# EAGLE design ArmazEthernet - Rev A3 (EAGLE 7.6.0)

## Sheet 1 of 2
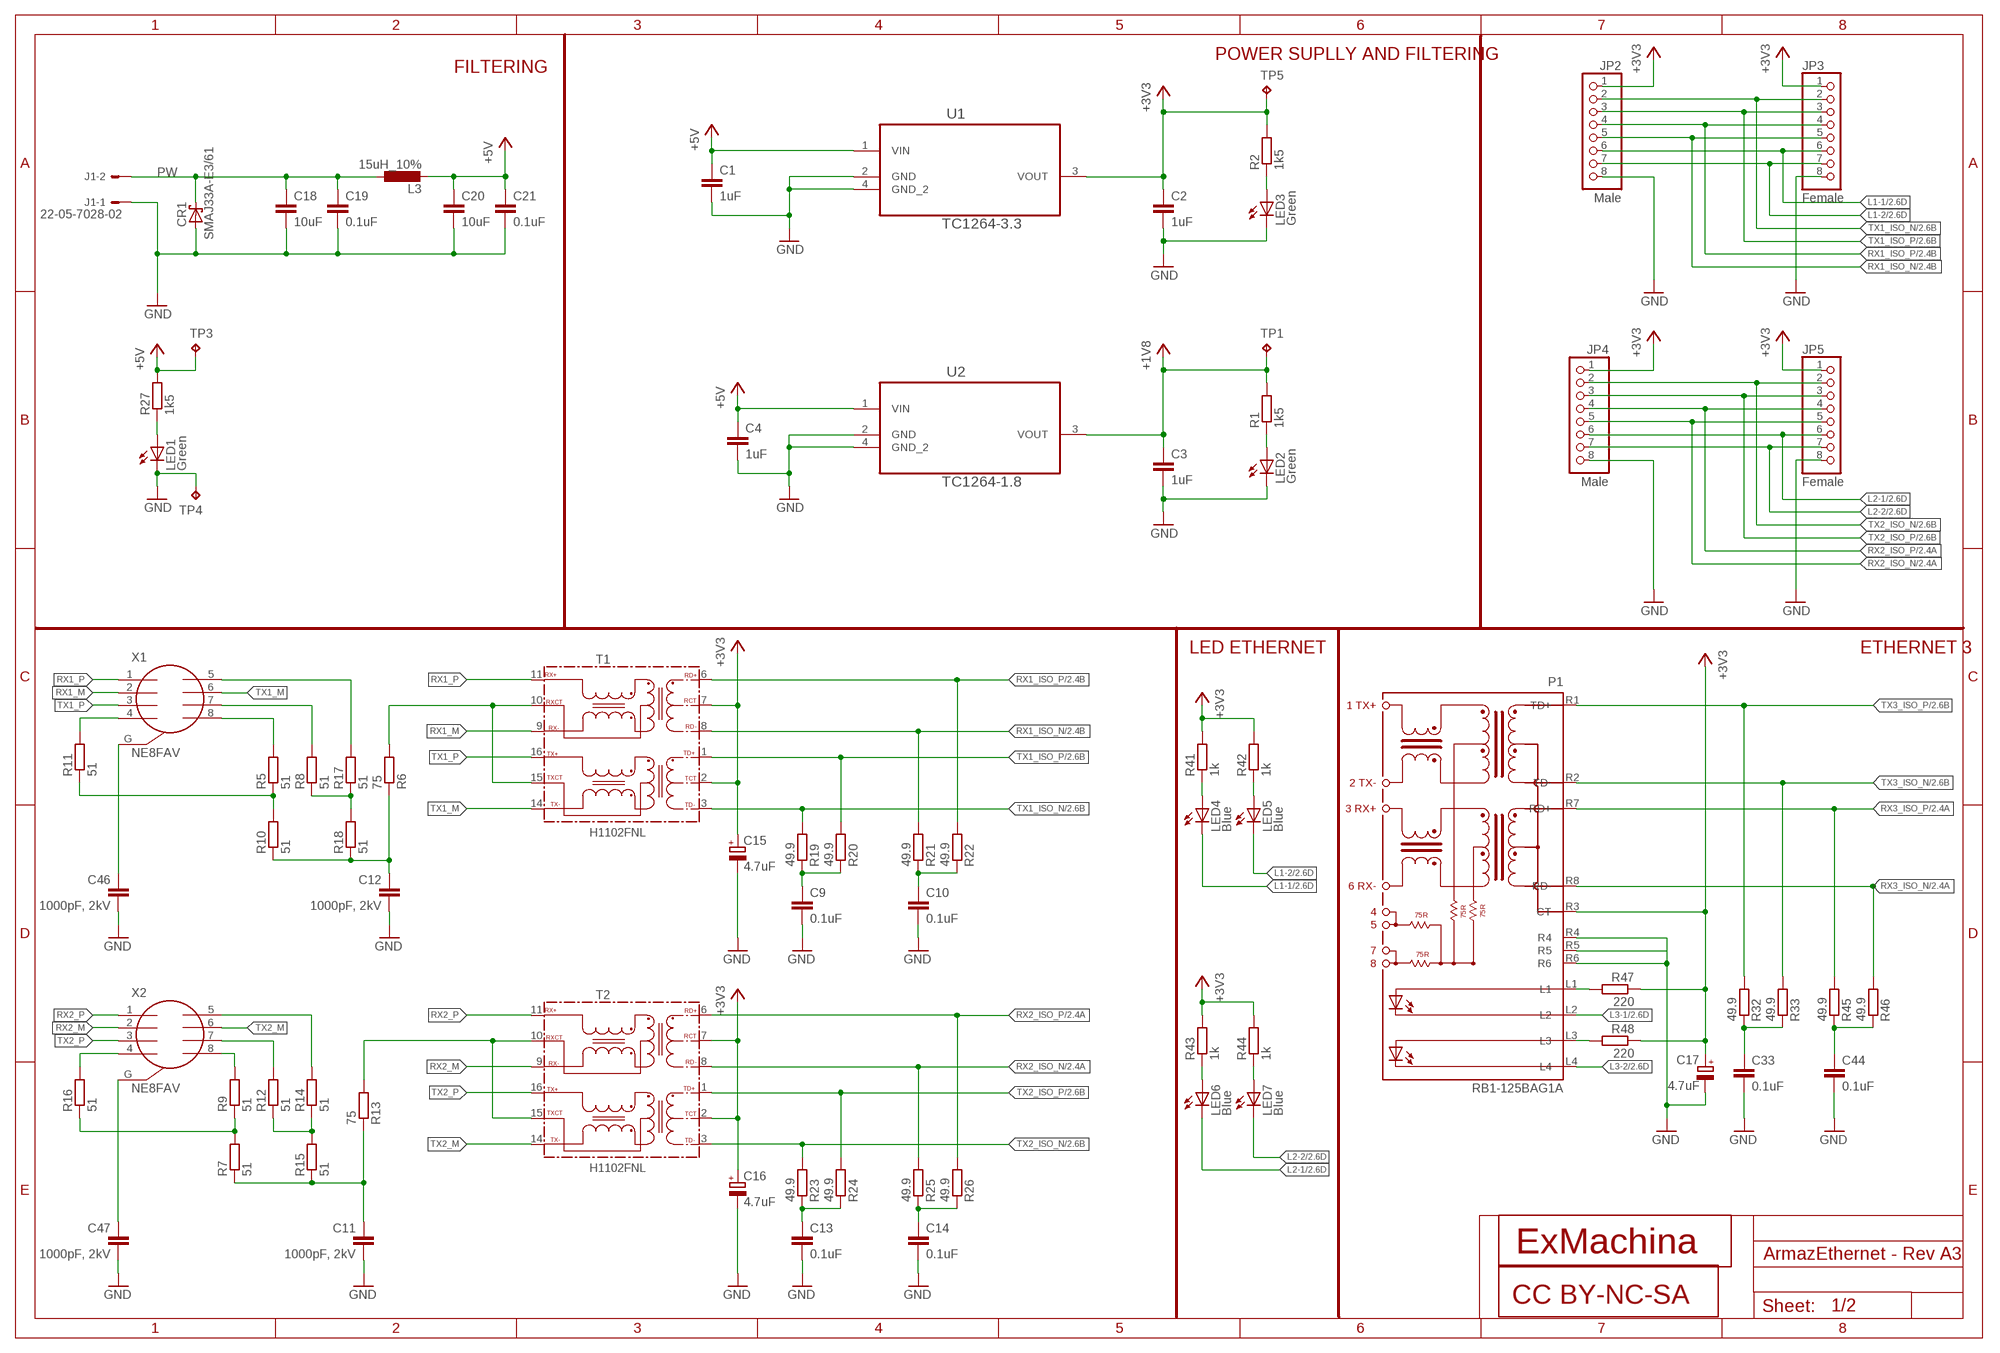
[diagram p0: schematic, sheet 1]

### Parts
C1  1uF  C-EUC0603  [C0603]
C2  1uF  C-EUC0603  [C0603]
C3  1uF  C-EUC0603  [C0603]
C4  1uF  C-EUC0603  [C0603]
C9  0.1uF  C-EUC0603  [C0603]
C10  0.1uF  C-EUC0603  [C0603]
C11  1000pF, 2kV  C-EUC1206  [C1206]
C12  1000pF, 2kV  C-EUC1206  [C1206]
C13  0.1uF  C-EUC0603  [C0603]
C14  0.1uF  C-EUC0603  [C0603]
C15  4.7uF  CPOL-EUCT3216  [CT3216]
C16  4.7uF  CPOL-EUCT3216  [CT3216]
C17  4.7uF  CPOL-EUCT3216  [CT3216]
C18  10uF  C-EUC0603  [C0603]
C19  0.1uF  C-EUC0603  [C0603]
C20  10uF  C-EUC0603  [C0603]
C21  0.1uF  C-EUC0603  [C0603]
C33  0.1uF  C-EUC0603  [C0603]
C44  0.1uF  C-EUC0603  [C0603]
C46  1000pF, 2kV  C-EUC1206  [C1206]
C47  1000pF, 2kV  C-EUC1206  [C1206]
CR1  SMAJ33A-E3/61  [DIODE_DO-214AC]
J1  22-05-7028-02  [7395-02]
JP2  Male  PINHD-1X8  [1X08]
JP3  Female  PINHD-1X8  [1X08]
JP4  Male  PINHD-1X8  [1X08]
JP5  Female  PINHD-1X8  [1X08]
L3  15uH_10%  L-EUL4532C  [L4532M]
LED1  Green  LEDCHIP-LED0603  [CHIP-LED0603]
LED2  Green  LEDCHIP-LED0603  [CHIP-LED0603]
LED3  Green  LEDCHIP-LED0603  [CHIP-LED0603]
LED4  Blue  LEDCHIP-LED0603  [CHIP-LED0603]
LED5  Blue  LEDCHIP-LED0603  [CHIP-LED0603]
LED6  Blue  LEDCHIP-LED0603  [CHIP-LED0603]
LED7  Blue  LEDCHIP-LED0603  [CHIP-LED0603]
P1  RB1-125BAG1A  [WIZNET_RB1-125BAG1A]
R1  1k5  R-EU_R0603  [R0603]
R2  1k5  R-EU_R0603  [R0603]
R5  51  R-EU_R0603  [R0603]
R6  75  R-EU_R0603  [R0603]
R7  51  R-EU_R0603  [R0603]
R8  51  R-EU_R0603  [R0603]
R9  51  R-EU_R0603  [R0603]
R10  51  R-EU_R0603  [R0603]
R11  51  R-EU_R0603  [R0603]
R12  51  R-EU_R0603  [R0603]
R13  75  R-EU_R0603  [R0603]
R14  51  R-EU_R0603  [R0603]
R15  51  R-EU_R0603  [R0603]
R16  51  R-EU_R0603  [R0603]
R17  51  R-EU_R0603  [R0603]
R18  51  R-EU_R0603  [R0603]
R19  49.9  R-EU_R0603  [R0603]
R20  49.9  R-EU_R0603  [R0603]
R21  49.9  R-EU_R0603  [R0603]
R22  49.9  R-EU_R0603  [R0603]
R23  49.9  R-EU_R0603  [R0603]
R24  49.9  R-EU_R0603  [R0603]
R25  49.9  R-EU_R0603  [R0603]
R26  49.9  R-EU_R0603  [R0603]
R27  1k5  R-EU_R0603  [R0603]
R32  49.9  R-EU_R0603  [R0603]
R33  49.9  R-EU_R0603  [R0603]
R41  1k  R-EU_R0603  [R0603]
R42  1k  R-EU_R0603  [R0603]
R43  1k  R-EU_R0603  [R0603]
R44  1k  R-EU_R0603  [R0603]
R45  49.9  R-EU_R0603  [R0603]
R46  49.9  R-EU_R0603  [R0603]
R47  220  R-EU_R0603  [R0603]
R48  220  R-EU_R0603  [R0603]
T1  H1102FNL  [HXXXX]
T2  H1102FNL  [HXXXX]
TP1  TPB1,27  [B1,27]
TP3  TPB1,27  [B1,27]
TP4  TPB1,27  [B1,27]
TP5  TPB1,27  [B1,27]
U1  TC1264-3.3  [SOT230P700X180-4N]
U2  TC1264-1.8  [SOT230P700X180-4N]
U$5  EXMACHINA-LOGO-NAME  [EXM-LOGO-BASELINE]
U$6  CC-BY-NC-SA  [CC-BY-NC-SA]
X1  NE8FAV  [NE8FAV]
X2  NE8FAV  [NE8FAV]

### Nets
+1V8: C3.1 R1.2 TP1.TP U2.3(VOUT) ; also sheet 2
+3V3: C2.1 C15.+ C16.+ C17.+ JP2.1 JP3.1 JP4.1 JP5.1 P1.R3(CT) R2.2 R41.2 R42.2 R43.2 R44.2 R47.1 R48.1 T1.2(TCT) T1.7(RCT) T2.2(TCT) T2.7(RCT) TP5.TP U1.3(VOUT) ; also sheet 2
+5V: C1.1 C4.1 C20.1 C21.1 L3.2 R27.2 TP3.TP U1.1(VIN) U2.1(VIN)
GND: C1.2 C2.2 C3.2 C4.2 C9.2 C10.2 C11.2 C12.2 C13.2 C14.2 C15.- C16.- C17.- C18.2 C19.2 C20.2 C21.2 C33.2 C44.2 C46.2 C47.2 CR1.2(A) J1.1 JP2.8 JP3.8 JP4.8 JP5.8 LED1.C LED2.C LED3.C P1.R4 P1.R5 P1.R6 TP4.TP U1.2(GND) U1.4(GND_2) U2.2(GND) U2.4(GND_2) ; also sheet 2
L1-1: JP2.6 JP3.6 LED4.C ; also sheet 2
L1-2: JP2.7 JP3.7 LED5.C ; also sheet 2
L2-1: JP4.6 JP5.6 LED6.C ; also sheet 2
L2-2: JP4.7 JP5.7 LED7.C ; also sheet 2
L3-1: P1.L2 ; also sheet 2
L3-2: P1.L4 ; also sheet 2
N$1: R6.2 T1.10(RXCT) T1.15(TXCT)
N$2: LED2.A R1.1
N$4: R13.2 T2.10(RXCT) T2.15(TXCT)
N$5: R9.2 X2.8
N$6: LED3.A R2.1
N$7: R11.2 X1.4
N$8: R5.2 X1.8
N$9: R8.2 X1.7
N$10: C9.1 R19.1 R20.1
N$11: R17.2 X1.5
N$12: R12.2 X2.7
N$13: C11.1 R7.1 R13.1 R15.1
N$14: R5.1 R10.2 R11.1
N$15: R16.2 X2.4
N$16: R7.2 R9.1 R16.1
N$17: R8.1 R17.1 R18.2
N$18: R14.2 X2.5
N$19: R12.1 R14.1 R15.2
N$20: LED4.A R41.1
N$23: LED1.A R27.1
N$27: C33.1 R32.1 R33.1
N$28: LED5.A R42.1
N$29: LED6.A R43.1
N$30: LED7.A R44.1
N$31: C44.1 R45.1 R46.1
N$32: C12.1 R6.1 R10.1 R18.1
N$33: C10.1 R21.1 R22.1
N$34: P1.L3 R48.2
N$35: P1.L1 R47.2
N$36: C47.1 X2.G
N$37: C46.1 X1.G
N$40: C13.1 R23.1 R24.1
N$41: C14.1 R25.1 R26.1
PW: C18.1 C19.1 CR1.1(C) J1.2 L3.1
RX1_ISO_N: JP2.5 JP3.5 R21.2 T1.8(RD-) ; also sheet 2
RX1_ISO_P: JP2.4 JP3.4 R22.2 T1.6(RD+) ; also sheet 2
RX1_M: T1.9(RX-) X1.2
RX1_P: T1.11(RX+) X1.1
RX2_ISO_N: JP4.5 JP5.5 R25.2 T2.8(RD-) ; also sheet 2
RX2_ISO_P: JP4.4 JP5.4 R26.2 T2.6(RD+) ; also sheet 2
RX2_M: T2.9(RX-) X2.2
RX2_P: T2.11(RX+) X2.1
RX3_ISO_N: P1.R8(RD-) R46.2 ; also sheet 2
RX3_ISO_P: P1.R7(RD+) R45.2 ; also sheet 2
TX1_ISO_N: JP2.2 JP3.2 R19.2 T1.3(TD-) ; also sheet 2
TX1_ISO_P: JP2.3 JP3.3 R20.2 T1.1(TD+) ; also sheet 2
TX1_M: T1.14(TX-) X1.6
TX1_P: T1.16(TX+) X1.3
TX2_ISO_N: JP4.2 JP5.2 R23.2 T2.3(TD-) ; also sheet 2
TX2_ISO_P: JP4.3 JP5.3 R24.2 T2.1(TD+) ; also sheet 2
TX2_M: T2.14(TX-) X2.6
TX2_P: T2.16(TX+) X2.3
TX3_ISO_N: P1.R2(TD-) R33.2 ; also sheet 2
TX3_ISO_P: P1.R1(TD+) R32.2 ; also sheet 2

### Notes on the sheet
- POWER SUPLLY AND FILTERING
- FILTERING
- LED ETHERNET | ETHERNET 3

## Sheet 2 of 2
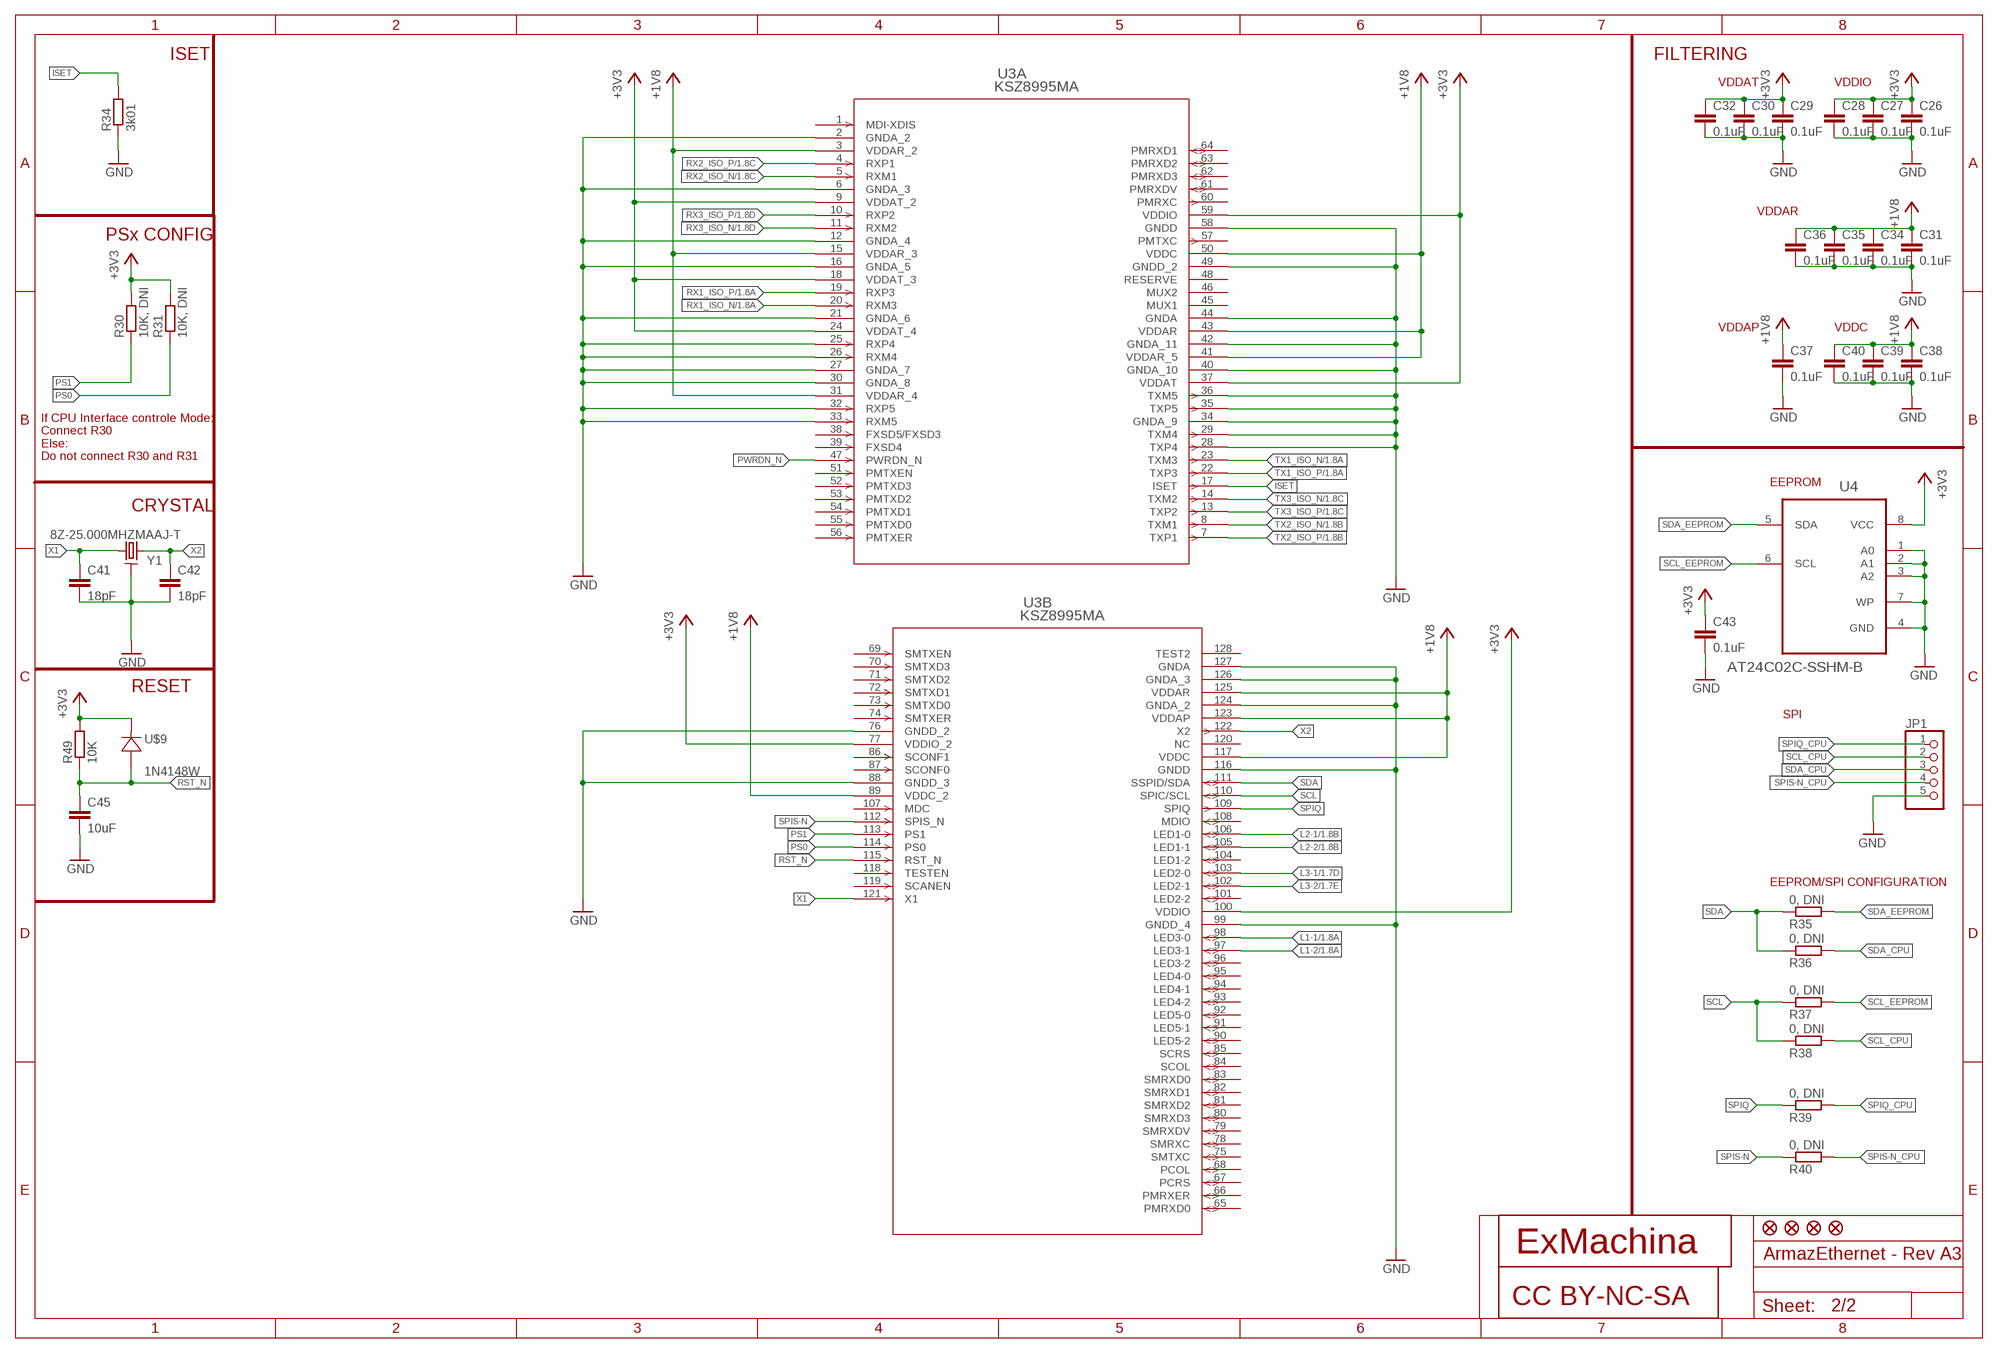
[diagram p1: schematic, sheet 2]

### Parts
C26  0.1uF  C-EUC0603  [C0603]
C27  0.1uF  C-EUC0603  [C0603]
C28  0.1uF  C-EUC0603  [C0603]
C29  0.1uF  C-EUC0603  [C0603]
C30  0.1uF  C-EUC0603  [C0603]
C31  0.1uF  C-EUC0603  [C0603]
C32  0.1uF  C-EUC0603  [C0603]
C34  0.1uF  C-EUC0603  [C0603]
C35  0.1uF  C-EUC0603  [C0603]
C36  0.1uF  C-EUC0603  [C0603]
C37  0.1uF  C-EUC0603  [C0603]
C38  0.1uF  C-EUC0603  [C0603]
C39  0.1uF  C-EUC0603  [C0603]
C40  0.1uF  C-EUC0603  [C0603]
C41  18pF  C-EUC0603  [C0603]
C42  18pF  C-EUC0603  [C0603]
C43  0.1uF  C-EUC0603  [C0603]
C45  10uF  C-EUC0603  [C0603]
JP1  PINHD-1X5  [1X05]
JP7  FIDUCIAL1X2  [FIDUCIAL-1X2]
JP8  FIDUCIAL1X2  [FIDUCIAL-1X2]
JP9  FIDUCIAL1X2  [FIDUCIAL-1X2]
JP10  FIDUCIAL1X2  [FIDUCIAL-1X2]
R30  10K, DNI  R-EU_R0603  [R0603]
R31  10K, DNI  R-EU_R0603  [R0603]
R34  3k01  R-EU_R0603  [R0603]
R35  0, DNI  R-EU_R0603  [R0603]
R36  0, DNI  R-EU_R0603  [R0603]
R37  0, DNI  R-EU_R0603  [R0603]
R38  0, DNI  R-EU_R0603  [R0603]
R39  0, DNI  R-EU_R0603  [R0603]
R40  0, DNI  R-EU_R0603  [R0603]
R49  10K  R-EU_R0603  [R0603]
U3  KSZ8995MA  [PQFP-128_MQL]
U4  AT24C02C-SSHM-B  [SOIC127P600X175-8N]
U$7  CC-BY-NC-SA  [CC-BY-NC-SA]
U$8  EXMACHINA-LOGO-NAME  [EXM-LOGO-BASELINE]
U$9  1N4148W  [SOD-123_MINI-SMA]
Y1  8Z-25.000MHZMAAJ-T  [SMD2.5X2]

### Nets
+1V8: C31.1 C34.1 C35.1 C36.1 C37.1 C38.1 C39.1 C40.1 U3.3(A:VDDAR_2) U3.15(A:VDDAR_3) U3.31(A:VDDAR_4) U3.41(A:VDDAR_5) U3.43(A:VDDAR) U3.50(A:VDDC) U3.89(B:VDDC_2) U3.117(B:VDDC) U3.123(B:VDDAP) U3.125(B:VDDAR) ; also sheet 1
+3V3: C26.1 C27.1 C28.1 C29.1 C30.1 C32.1 C43.1 R30.2 R31.2 R49.2 U3.9(A:VDDAT_2) U3.18(A:VDDAT_3) U3.24(A:VDDAT_4) U3.37(A:VDDAT) U3.59(A:VDDIO) U3.77(B:VDDIO_2) U3.100(B:VDDIO) U4.8(VCC) U$9.C ; also sheet 1
GND: C26.2 C27.2 C28.2 C29.2 C30.2 C31.2 C32.2 C34.2 C35.2 C36.2 C37.2 C38.2 C39.2 C40.2 C41.2 C42.2 C43.2 C45.2 JP1.5 R34.1 U3.2(A:GNDA_2) U3.6(A:GNDA_3) U3.12(A:GNDA_4) U3.16(A:GNDA_5) U3.21(A:GNDA_6) U3.25(A:RXP4) U3.26(A:RXM4) U3.27(A:GNDA_7) U3.28(A:TXP4) U3.29(A:TXM4) U3.30(A:GNDA_8) U3.32(A:RXP5) U3.33(A:RXM5) U3.34(A:GNDA_9) U3.35(A:TXP5) U3.36(A:TXM5) U3.40(A:GNDA_10) U3.42(A:GNDA_11) U3.44(A:GNDA) U3.49(A:GNDD_2) U3.58(A:GNDD) U3.76(B:GNDD_2) U3.88(B:GNDD_3) U3.99(B:GNDD_4) U3.116(B:GNDD) U3.124(B:GNDA_2) U3.126(B:GNDA_3) U3.127(B:GNDA) U4.1(A0) U4.2(A1) U4.3(A2) U4.4(GND) U4.7(WP) Y1.2 Y1.4 ; also sheet 1
ISET: R34.2 U3.17(A:ISET)
L1-1: U3.98(B:LED3-0) ; also sheet 1
L1-2: U3.97(B:LED3-1) ; also sheet 1
L2-1: U3.106(B:LED1-0) ; also sheet 1
L2-2: U3.105(B:LED1-1) ; also sheet 1
L3-1: U3.103(B:LED2-0) ; also sheet 1
L3-2: U3.102(B:LED2-1) ; also sheet 1
PS0: R31.1 U3.114(B:PS0)
PS1: R30.1 U3.113(B:PS1)
PWRDN_N: U3.47(A:PWRDN_N)
RST_N: C45.1 R49.1 U3.115(B:RST_N) U$9.A
RX1_ISO_N: U3.20(A:RXM3) ; also sheet 1
RX1_ISO_P: U3.19(A:RXP3) ; also sheet 1
RX2_ISO_N: U3.5(A:RXM1) ; also sheet 1
RX2_ISO_P: U3.4(A:RXP1) ; also sheet 1
RX3_ISO_N: U3.11(A:RXM2) ; also sheet 1
RX3_ISO_P: U3.10(A:RXP2) ; also sheet 1
SCL: R37.1 R38.1 U3.110(B:SPIC/SCL)
SCL_CPU: JP1.2 R38.2
SCL_EEPROM: R37.2 U4.6(SCL)
SDA: R35.1 R36.1 U3.111(B:SSPID/SDA)
SDA_CPU: JP1.3 R36.2
SDA_EEPROM: R35.2 U4.5(SDA)
SPIQ: R39.1 U3.109(B:SPIQ)
SPIQ_CPU: JP1.1 R39.2
SPIS-N: R40.1 U3.112(B:SPIS_N)
SPIS-N_CPU: JP1.4 R40.2
TX1_ISO_N: U3.23(A:TXM3) ; also sheet 1
TX1_ISO_P: U3.22(A:TXP3) ; also sheet 1
TX2_ISO_N: U3.8(A:TXM1) ; also sheet 1
TX2_ISO_P: U3.7(A:TXP1) ; also sheet 1
TX3_ISO_N: U3.14(A:TXM2) ; also sheet 1
TX3_ISO_P: U3.13(A:TXP2) ; also sheet 1
X1: C41.1 U3.121(B:X1) Y1.1
X2: C42.1 U3.122(B:X2) Y1.3
Unconnected: U3.1(A:MDI-XDIS) U3.38(A:FXSD5/FXSD3) U3.39(A:FXSD4) U3.45(A:MUX1) U3.46(A:MUX2) U3.48(A:RESERVE) U3.51(A:PMTXEN) U3.52(A:PMTXD3) U3.53(A:PMTXD2) U3.54(A:PMTXD1) U3.55(A:PMTXD0) U3.56(A:PMTXER) U3.57(A:PMTXC) U3.60(A:PMRXC) U3.61(A:PMRXDV) U3.62(A:PMRXD3) U3.63(A:PMRXD2) U3.64(A:PMRXD1) U3.65(B:PMRXD0) U3.66(B:PMRXER) U3.67(B:PCRS) U3.68(B:PCOL) U3.69(B:SMTXEN) U3.70(B:SMTXD3) U3.71(B:SMTXD2) U3.72(B:SMTXD1) U3.73(B:SMTXD0) U3.74(B:SMTXER) U3.75(B:SMTXC) U3.78(B:SMRXC) U3.79(B:SMRXDV) U3.80(B:SMRXD3) U3.81(B:SMRXD2) U3.82(B:SMRXD1) U3.83(B:SMRXD0) U3.84(B:SCOL) U3.85(B:SCRS) U3.86(B:SCONF1) U3.87(B:SCONF0) U3.90(B:LED5-2) U3.91(B:LED5-1) U3.92(B:LED5-0) U3.93(B:LED4-2) U3.94(B:LED4-1) U3.95(B:LED4-0) U3.96(B:LED3-2) U3.101(B:LED2-2) U3.104(B:LED1-2) U3.107(B:MDC) U3.108(B:MDIO) U3.118(B:TESTEN) U3.119(B:SCANEN) U3.120(B:NC) U3.128(B:TEST2)

### Notes on the sheet
- ISET | FILTERING
- VDDAT | VDDIO
- VDDAR
- PSx CONFIG
- VDDAP | VDDC
- If CPU Interface controle Mode:
  Connect R30
  Else:
  Do not connect R30 and R31
- EEPROM
- CRYSTAL
- RESET
- SPI
- EEPROM/SPI CONFIGURATION

## Library data of the parts
C1-C4 = rcl:C-EU: CAPACITOR, European symbol; OC_FARNELL: unknown
C9 C10 C13 C14 C19 C21 C26-C40 C43 C44 = rcl:C-EU: CAPACITOR, European symbol; MF: MULTICOMP; MPN: MC0603B104K250CT; OC_FARNELL: 1759037; OC_NEWARK: 06R4923
C11 C12 C46 C47 = rcl:C-EU: CAPACITOR, European symbol; OC_FARNELL: unknown; OC_NEWARK: 21T9879
C15-C17 = rcl:CPOL-EU: POLARIZED CAPACITOR, European symbol; OC_FARNELL: unknown; OC_NEWARK: 01M8221
C18 C20 C45 = rcl:C-EU: CAPACITOR, European symbol; MF: MURATA; MPN: GRM32DR71C106KA01L; OC_FARNELL: 2494299; OC_NEWARK: 13M5149
C41 C42 = rcl:C-EU: CAPACITOR, European symbol; MF: MULTICOMP; MPN: MC0603B183K160CT; OC_FARNELL: 1759006; OC_NEWARK: 06R5138
CR1 = diode:SMAJ33A-E3/61; COPYRIGHT: Copyright (C) 2015 Accelerated Designs. All rights reserved; FAMILY: TVS; MANUFACTURER_NAME: Vishay; MANUFACTURER_PART_NUMBER: SMAJ33A-E3/61; MF: VISHAY; MPN: SMAJ33A-E3/5A; OC_FARNELL: 1812505; OC_NEWARK: 08R3790; RSPARTNUMBER: 7103462; SECTION: Discretes; SUPERSECTION: Semiconductors; VENDOR: Vishay
J1 = con-molex:22-?-02: CONNECTOR wire to board 2.54 mm (.1 inch) pitch header; MF: MOLEX; MPN: 22-05-7028; OC_FARNELL: 9731601; OC_NEWARK: 25M1728
JP1 = pinhead:PINHD-1X5: PIN HEADER; OC_FARNELL: unknown; OC_NEWARK: 97K6210
JP2 JP4 = pinhead:PINHD-1X8: PIN HEADER; MF: SAMTEC; MPN: TSW-108-15-T-S; OC_FARNELL: 2037596; OC_NEWARK: 08N6749
JP3 JP5 = pinhead:PINHD-1X8: PIN HEADER; MF: SAMTEC; MPN: SLW-108-01-T-S; OC_FARNELL: 1803516; OC_NEWARK: 08N6773
JP7-JP10 = SparkFun:FIDUCIAL: Fiducial Alignment Points Various fiducial points for machine vision alignment.; OC_FARNELL: unknown
L3 = rcl:L-EU: INDUCTOR, European symbol; OC_FARNELL: unknown; OC_NEWARK: 74M2809
LED1-LED3 = led:LED: LED OSRAM: - CHIPLED LG R971, LG N971, LY N971, LG Q971, LY Q971, LO R971, LY R971 LH N974, LH R974 LS Q976, LO Q976, LY Q976 LO Q996 - Hyper CHIPLED LW Q18S LB Q993, LB Q99A, LB R99A - SideLED LS A670, LO A670, LY A670, LG A670, LP A670 LB A673, LV A673, LT A673, LW A673 LH A674 LY A675 LS A676, LA A676, LO A676, LY A676, LW A676 LS A679, LY A679, LG A679 - Hyper Micro SIDELED® LS Y876, LA Y876, LO Y876, LY Y876 LT Y87S - SmartLED LW L88C, LW L88S LB L89C, LB L89S, LG L890 LS L89K, LO L89K, LY L89K LS L896, LA L896, LO L896, LY L896 - TOPLED LS T670, LO T670, LY T670, LG T670, LP T670 LSG T670, LSP T670, LSY T670, LOP T670, LYG T670 LG T671, LOG T671, LSG T671 LB T673, LV T673, LT T673, LW T673 LH T674 LS T676, LA T676, LO T676, LY T676, LB T676, LH T676, LSB T676, LW T676 LB T67C, LV T67C, LT T67C, LS T67K, LO T67K, LY T67K, LW E67C LS E67B, LA E67B, LO E67B, LY E67B, LB E67C, LV E67C, LT E67C LW T67C LS T679, LY T679, LG T679 LS T770, LO T770, LY T770, LG T770, LP T770 LB T773, LV T773, LT T773, LW T773 LH T774 LS E675, LA E675, LY E675, LS T675 LS T776, LA T776, LO T776, LY T776, LB T776 LHGB T686 LT T68C, LB T68C - Hyper Mini TOPLED® LB M676 - Mini TOPLED Santana® LG M470 LS M47K, LO M47K, LY M47K Source: http://www.osram.convergy.de LUXEON: - LUMILED® LXK2-PW12-R00, LXK2-PW12-S00, LXK2-PW14-U00, LXK2-PW14-V00 LXK2-PM12-R00, LXK2-PM12-S00, LXK2-PM14-U00 LXK2-PE12-Q00, LXK2-PE12-R00, LXK2-PE12-S00, LXK2-PE14-T00, LXK2-PE14-U00 LXK2-PB12-K00, LXK2-PB12-L00, LXK2-PB12-M00, LXK2-PB14-N00, LXK2-PB14-P00, LXK2-PB14-Q00 LXK2-PR12-L00, LXK2-PR12-M00, LXK2-PR14-Q00, LXK2-PR14-R00 LXK2-PD12-Q00, LXK2-PD12-R00, LXK2-PD12-S00 LXK2-PH12-R00, LXK2-PH12-S00 LXK2-PL12-P00, LXK2-PL12-Q00, LXK2-PL12-R00 Source: www.luxeon.com KINGBRIGHT: KA-3528ASYC Source: www.kingbright.com; MF: MULTICOMP; MPN: OVS-0604; OC_FARNELL: 1716771; OC_NEWARK: 15R2206
LED4-LED7 = led:LED: LED OSRAM: - CHIPLED LG R971, LG N971, LY N971, LG Q971, LY Q971, LO R971, LY R971 LH N974, LH R974 LS Q976, LO Q976, LY Q976 LO Q996 - Hyper CHIPLED LW Q18S LB Q993, LB Q99A, LB R99A - SideLED LS A670, LO A670, LY A670, LG A670, LP A670 LB A673, LV A673, LT A673, LW A673 LH A674 LY A675 LS A676, LA A676, LO A676, LY A676, LW A676 LS A679, LY A679, LG A679 - Hyper Micro SIDELED® LS Y876, LA Y876, LO Y876, LY Y876 LT Y87S - SmartLED LW L88C, LW L88S LB L89C, LB L89S, LG L890 LS L89K, LO L89K, LY L89K LS L896, LA L896, LO L896, LY L896 - TOPLED LS T670, LO T670, LY T670, LG T670, LP T670 LSG T670, LSP T670, LSY T670, LOP T670, LYG T670 LG T671, LOG T671, LSG T671 LB T673, LV T673, LT T673, LW T673 LH T674 LS T676, LA T676, LO T676, LY T676, LB T676, LH T676, LSB T676, LW T676 LB T67C, LV T67C, LT T67C, LS T67K, LO T67K, LY T67K, LW E67C LS E67B, LA E67B, LO E67B, LY E67B, LB E67C, LV E67C, LT E67C LW T67C LS T679, LY T679, LG T679 LS T770, LO T770, LY T770, LG T770, LP T770 LB T773, LV T773, LT T773, LW T773 LH T774 LS E675, LA E675, LY E675, LS T675 LS T776, LA T776, LO T776, LY T776, LB T776 LHGB T686 LT T68C, LB T68C - Hyper Mini TOPLED® LB M676 - Mini TOPLED Santana® LG M470 LS M47K, LO M47K, LY M47K Source: http://www.osram.convergy.de LUXEON: - LUMILED® LXK2-PW12-R00, LXK2-PW12-S00, LXK2-PW14-U00, LXK2-PW14-V00 LXK2-PM12-R00, LXK2-PM12-S00, LXK2-PM14-U00 LXK2-PE12-Q00, LXK2-PE12-R00, LXK2-PE12-S00, LXK2-PE14-T00, LXK2-PE14-U00 LXK2-PB12-K00, LXK2-PB12-L00, LXK2-PB12-M00, LXK2-PB14-N00, LXK2-PB14-P00, LXK2-PB14-Q00 LXK2-PR12-L00, LXK2-PR12-M00, LXK2-PR14-Q00, LXK2-PR14-R00 LXK2-PD12-Q00, LXK2-PD12-R00, LXK2-PD12-S00 LXK2-PH12-R00, LXK2-PH12-S00 LXK2-PL12-P00, LXK2-PL12-Q00, LXK2-PL12-R00 Source: www.luxeon.com KINGBRIGHT: KA-3528ASYC Source: www.kingbright.com; MF: MULTICOMP; MPN: OVS-0603; OC_FARNELL: 1716770; OC_NEWARK: 15R2205
P1 = con-wiznet:RB1-125BAG1A: Accessory RJ-45 With Transformer Connector - UDE; OC_FARNELL: unknown; OC_NEWARK: unknown
R1 R2 R27 = rcl:R-EU_: RESISTOR, European symbol; MF: MULTICOMP; MPN: MCMR06X1501FTL; OC_FARNELL: 2073391; OC_NEWARK: 58K4488
R5 R7-R12 R14-R18 = rcl:R-EU_: RESISTOR, European symbol; MF: MULTICOMP; MPN: MCMR06X49R9FTL; OC_FARNELL: 2073520; OC_NEWARK: 58K4614
R6 R13 = rcl:R-EU_: RESISTOR, European symbol; MF: MULTICOMP; MPN: MCMR06X75R0FTL; OC_FARNELL: 2073571; OC_NEWARK: 58K4654
R19-R26 R32 R33 R45 R46 = rcl:R-EU_: RESISTOR, European symbol; MF: MULTICOMP; MPN: MCMR06X49R9FTL; OC_FARNELL: 2073520; OC_NEWARK: 79M5983
R30 R31 = rcl:R-EU_: RESISTOR, European symbol; OC_FARNELL: unknown; OC_NEWARK: 58K4450
R34 = rcl:R-EU_: RESISTOR, European symbol; MF: MULTICOMP; MPN: MCMR06X3001FTL; OC_FARNELL: 2073461; OC_NEWARK: 94W5780
R35-R40 = rcl:R-EU_: RESISTOR, European symbol; OC_FARNELL: unknown; OC_NEWARK: 58K4684
R41-R44 = rcl:R-EU_: RESISTOR, European symbol; MF: MULTICOMP; MPN: MCMR06X1001FTL; OC_FARNELL: 2073348; OC_NEWARK: 86T3505
R47 R48 = rcl:R-EU_: RESISTOR, European symbol; MF: MULTICOMP; MPN: MCMR06X2200FTL; OC_FARNELL: 2073428; OC_NEWARK: 58K4526
R49 = rcl:R-EU_: RESISTOR, European symbol; MF: MULTICOMP; MPN: MCMR06X1002FTL; OC_FARNELL: 2073349; OC_NEWARK: 58K4450
T1 T2 = pulse:H1102FNL; OC_FARNELL: unknown; OC_NEWARK: unknown
TP1 TP3-TP5 = testpad:TP: Test pad; OC_FARNELL: unknown; OC_NEWARK: unknown
U1 = microchip-6:TC1264-3.3: IC, 8 00mA Fixed Output CMOS LDO,3.3V,SOT-223, 3-lead; OC_FARNELL: unknown; PACKAGE: SOT-223-3; SUPPLIER: Microchip
U2 = microchip-6:TC1264-1.8: IC, 800mA Fixed Output CMOS LDO,1.8V,SOT-223, 3-lead; OC_FARNELL: unknown; PACKAGE: SOT-223-3; SUPPLIER: Microchip
U3 = Micrel_By_element14_Batch_1:KSZ8995MA; COPYRIGHT: Copyright (C) 2015 Accelerated Designs. All rights reserved; MANUFACTURER_PART_NUMBER: ksz8995ma; MF: MICROCHIP; MPN: KSZ8995MA; OC_FARNELL: 2509844; OC_NEWARK: 70Y9044; VENDOR: MICREL
U4 = atmel:AT24C02C-SSHM-B: SERIAL EEPROM IC Memory Size:2Kbit,8-SOIC; MF: ATMEL; MPN: AT24C02C-SSHM-B; OC_FARNELL: 1971995; OC_NEWARK: 68T4066; PACKAGE: 8SOIC; SUPPLIER: ATMEL
U$5 U$8 = exmachina:EXMACHINA-LOGO; OC_FARNELL: unknown; OC_NEWARK: unknown
U$6 U$7 = cc-by-sa:CC-BY-NC-SA; OC_FARNELL: unknown
U$9 = diode:1N4148W; OC_FARNELL: unknown; OC_NEWARK: 01P4213
X1 X2 = con-neutrik_ag:NE8; MF: NEUTRIK; MPN: NE8FAV; OC_FARNELL: 1202031; OC_NEWARK: 01M8373
Y1 = crystal:8Z; MF: TXC; MPN: 8Z-25.000MAAJ-T; OC_FARNELL: 1842189; OC_NEWARK: 84R5794

## Board
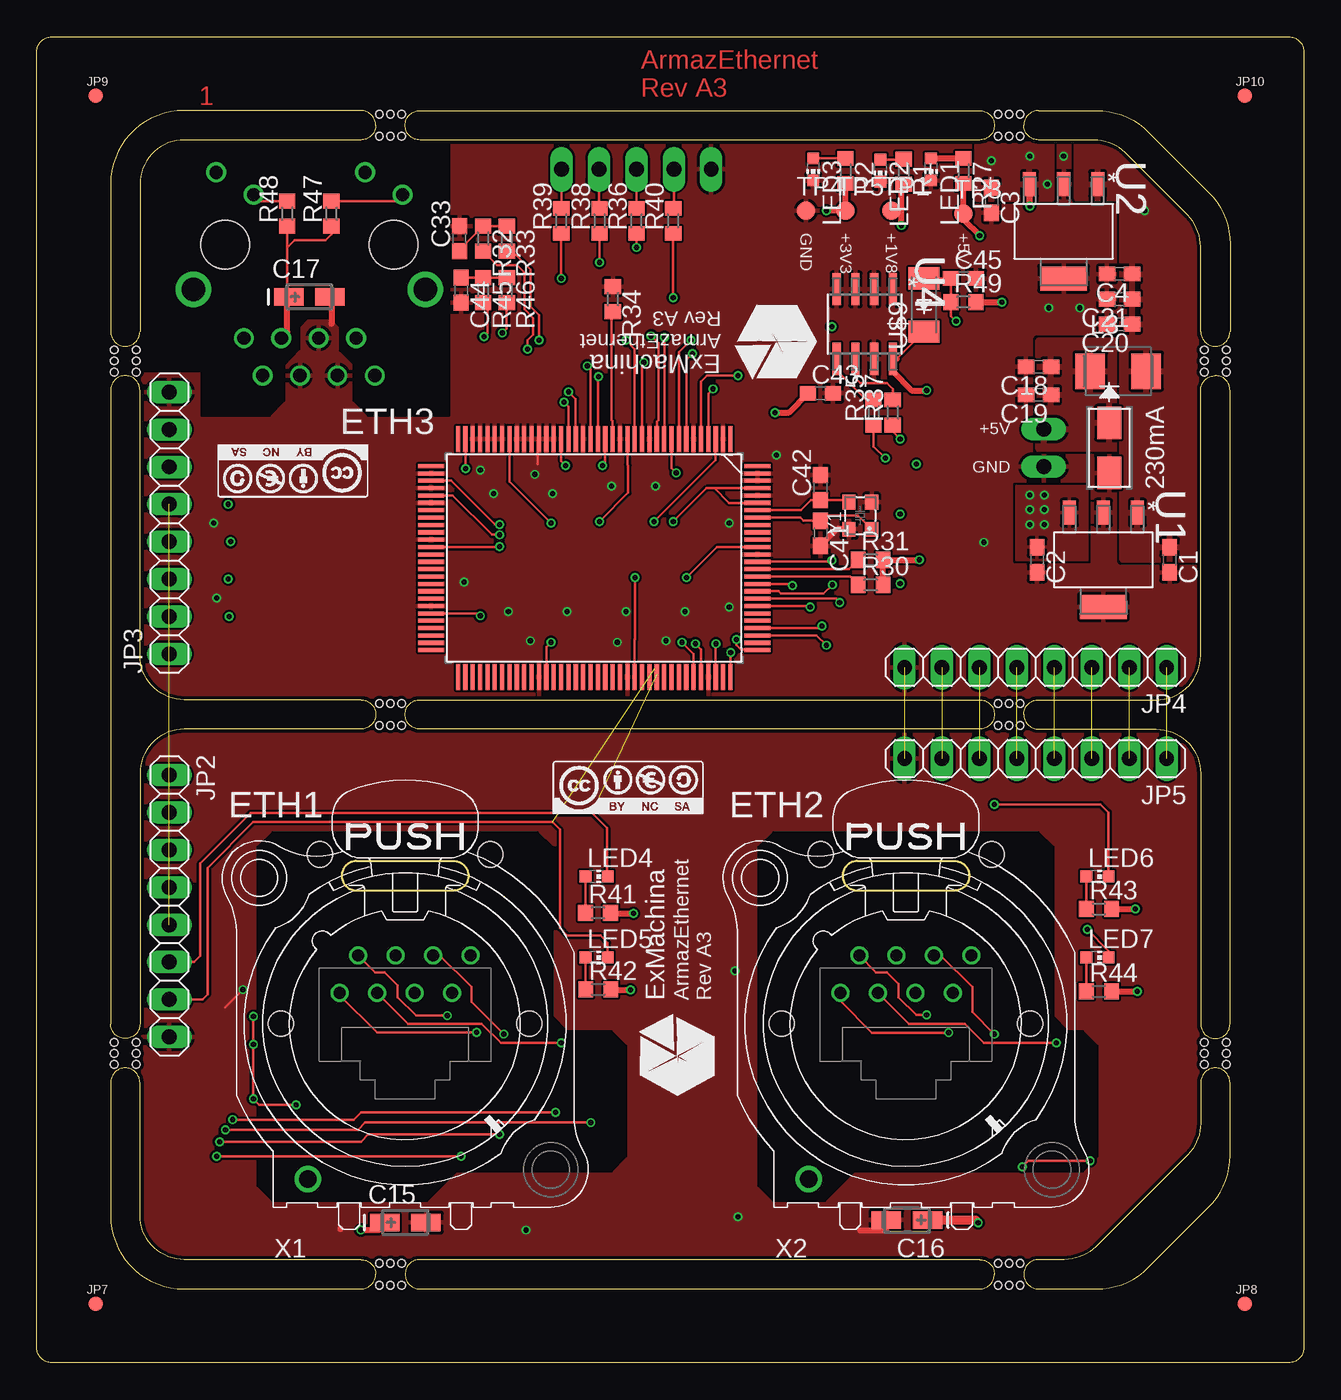
[diagram p2: board, top side]
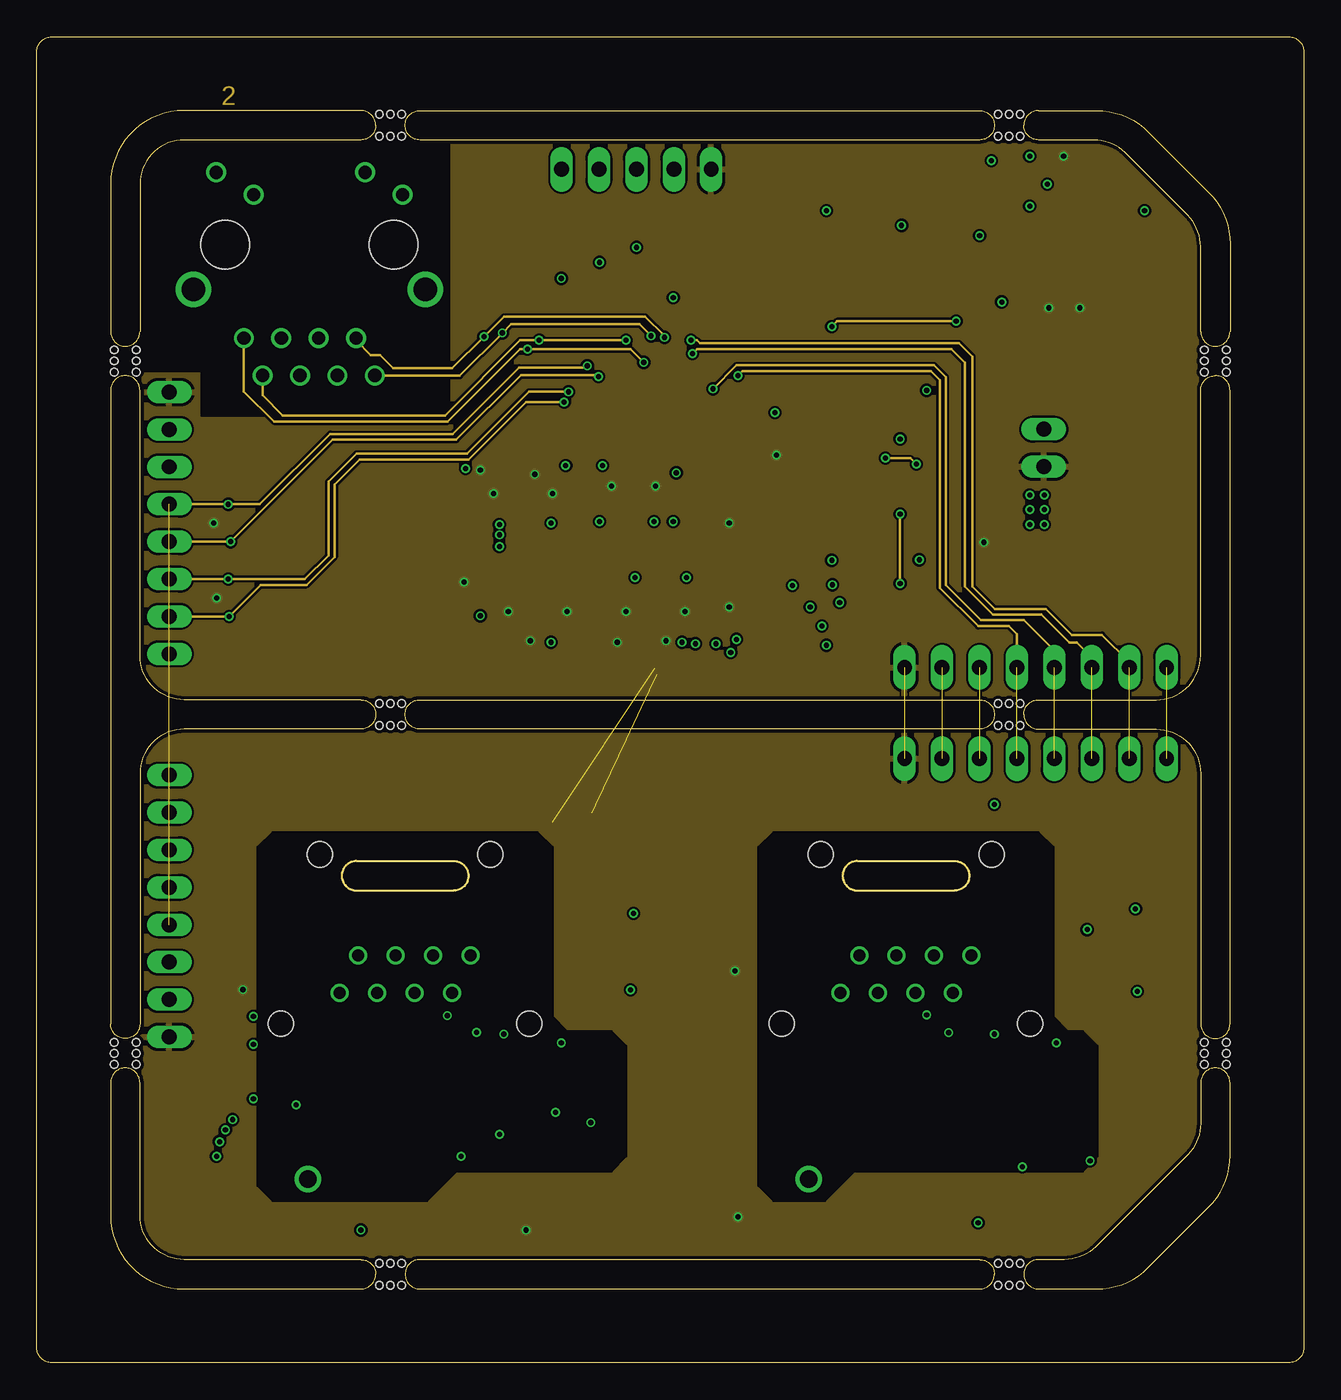
[diagram p3: board, inner layer Route2]
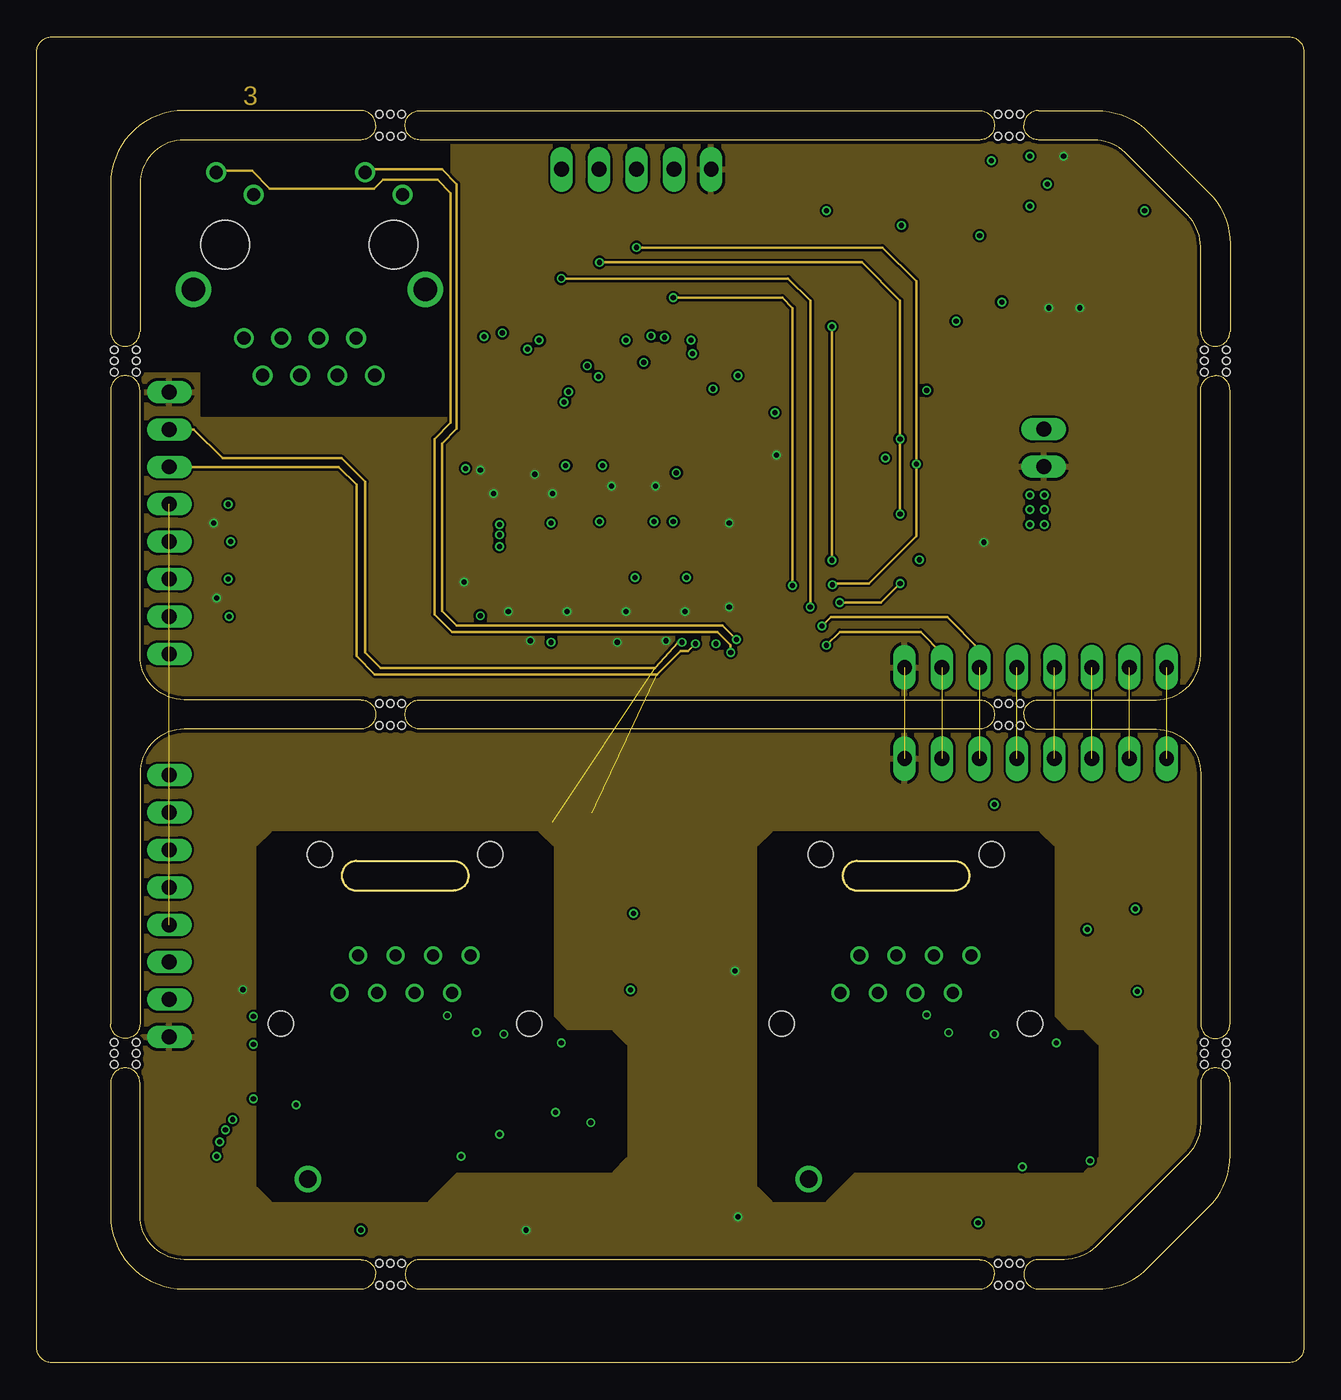
[diagram p4: board, inner layer Route15]
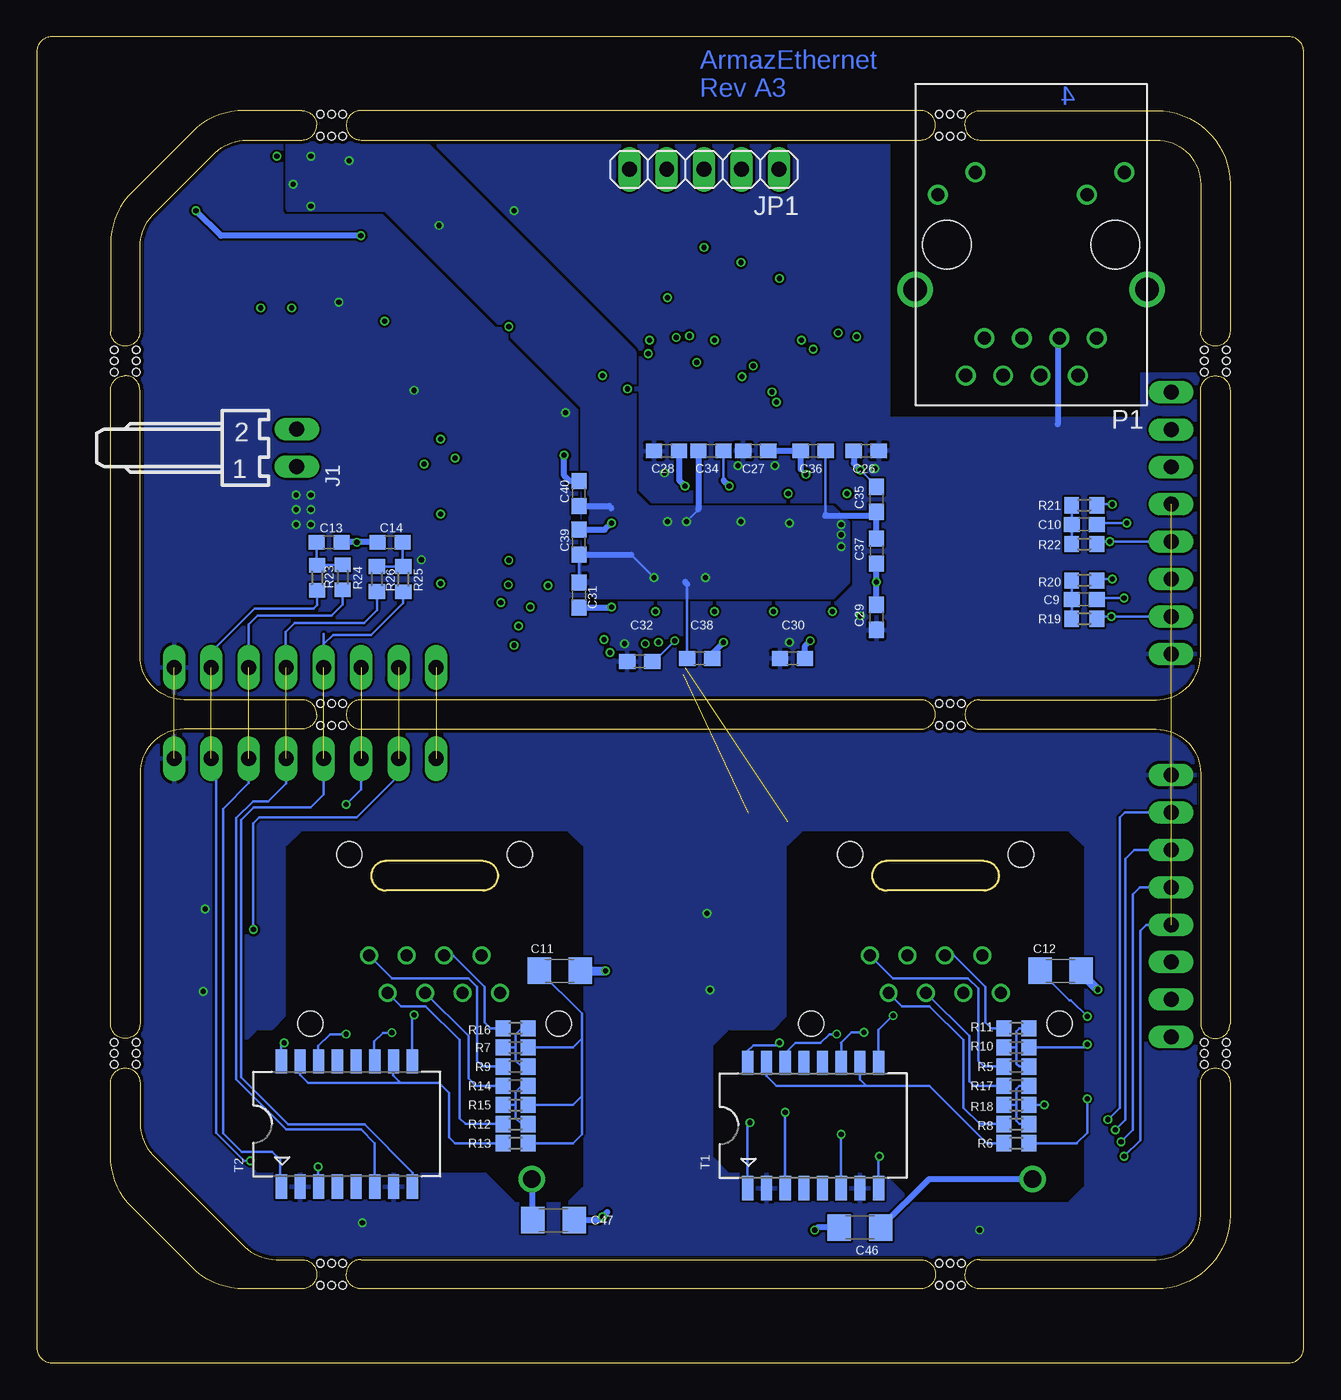
[diagram p5: board, bottom side, seen from below]

Size 86 x 90 mm. Coordinates in mm from the lower left corner, seen from the top.
Outline: 79,19 79,16.24 arc-45 78.12,14.12 71.88,7.88 arc-45 69.76,7 68,7 arc90 67,6 arc90 68,5 71.93,5 arc45 75.46,6.46 79.54,10.54 arc45 81,14.07 81,19 arc90 80,20 arc90 79,19
Outline: 64,7 26,7 arc90 25,6 arc90 26,5 64,5 arc90 65,6 arc90 64,7
Outline: 22,7 10,7 arc-90 7,10 7,19 arc90 6,20 arc90 5,19 5,10 arc90 10,5 22,5 arc90 23,6 arc90 22,7
Outline: 22,45 10,45 arc-90 7,48 7,66 arc90 6,67 arc90 5,66 5,23 arc90 6,22 arc90 7,23 7,40 arc-90 10,43 22,43 arc90 23,44 arc90 22,45
Outline: 68,43 76,43 arc-90 79,40 79,23 arc90 80,22 arc90 81,23 81,66 arc90 80,67 arc90 79,66 79,48 arc-90 76,45 68,45 arc90 67,44 arc90 68,43
Outline: 79,70 79,75.76 arc45 78.12,77.88 73.88,82.12 arc45 71.76,83 68,83 arc-90 67,84 arc-90 68,85 71.93,85 arc-45 75.46,83.54 79.54,79.46 arc-45 81,75.93 81,70 arc-90 80,69 arc-90 79,70
Outline: 26,45 64,45 arc-90 65,44 arc-90 64,43 26,43 arc-90 25,44 arc-90 26,45
Outline: 5,80 5,70 arc90 6,69 arc90 7,70 7,80 arc-90 10,83 22,83 arc90 23,84 arc90 22,85 10,85 arc90 5,80
Outline: 65,84 arc-90 64,83 26,83 arc-90 25,84 arc-90 26,85 64,85 arc-90 65,84
Outline: 0,1 0,89 arc-90 1,90 85,90 arc-90 86,89 86,1 arc-90 85,0 1,0 arc-90 0,1
Copper layers (1+2*15+16): Top 0.018mm / dielectric 0.36mm / Route2 0.035mm / dielectric 0.71mm / Route15 0.035mm / dielectric 0.2mm / Bottom 0.018mm
Design rules "eC_4Layer_PClass6_BaseCopperO18-I35_eCDefault *": minimum track width 7mil, minimum drill 0.35mm, track to track 0.15mm, track to pad 0.15mm, pad to pad 0.15mm, via to via 0.15mm, smd to smd 0mil, copper to edge 0.25mm, drill to drill 0.35mm, minimum pad ring 0.175mm, minimum via ring 0.125mm, stop-mask expansion 0mil, vias tented up to drill 0.5mm, thermal gap 0.2mm
Holes 0.5 mm at 5.25,67.25 5.25,68 5.25,68.75 6.75,68.75 6.75,68 6.75,67.25 24,84.75 23.25,84.75 24.75,84.75 23.25,83.25 24,83.25 24.75,83.25 65.25,84.75 66,84.75 66.75,84.75 65.25,83.25 66,83.25 66.75,83.25 79.25,68 79.25,68.75 79.25,67.25 80.75,67.25 80.75,68 80.75,68.75 79.25,21.75 79.25,21 79.25,20.25 80.75,20.25 80.75,21 80.75,21.75 66,6.75 65.25,6.75 66.75,6.75 66,5.25 66.75,5.25 65.25,5.25 24,6.75 24.75,6.75 23.25,6.75 23.25,5.25 24,5.25 24.75,5.25 5.25,21 5.25,21.75 5.25,20.25 6.75,20.25 6.75,21 6.75,21.75 24,44.75 23.25,44.75 24.75,44.75 24.75,43.25 24,43.25 23.25,43.25 66,44.75 65.25,44.75 66.75,44.75 66.75,43.25 66,43.25 65.25,43.25

### Footprints (pad centres in the part's own frame; a part is rotated, then mirrored left to right if it is on the bottom)
C0603 = smd 1.1 x 1: 1 -0.85,0; 2 0.85,0
C1206 = smd 1.6 x 1.8: 1 -1.4,0; 2 1.4,0
CT3216 = smd 2 x 1.2: + -1.4,0; - 1.4,0
DIODE_DO-214AC = smd 2.184 x 1.651: 1 -1.702,0; 2 1.702,0
7395-02 = drill 1.016 long: 1 1.27,0; 2 -1.27,0
1X05 = drill 1.016 long: 1 -5.08,0; 2 -2.54,0; 3 0,0; 4 2.54,0; 5 5.08,0
1X08 = drill 1.016 long: 1 -8.89,0; 2 -6.35,0; 3 -3.81,0; 4 -1.27,0; 5 1.27,0; 6 3.81,0; 7 6.35,0; 8 8.89,0
FIDUCIAL-1X2 = smd 1 x 1: 1 0,0
L4532M = smd 2 x 2.4: 1 -1.9,0; 2 1.9,0
CHIP-LED0603 = smd 0.8 x 0.8: A 0,-0.75; C 0,0.75
WIZNET_RB1-125BAG1A = drill 0.9: L1 6.325,-3.38; L2 3.784,-4.899; L3 -3.786,-3.379; L4 -6.325,-4.9 | drill 0.9 pad 1.3: R1 -4.446,6.349; R2 -3.176,8.889; R3 -1.906,6.349; R4 -0.636,8.889; R5 0.634,6.349; R6 1.904,8.889; R7 3.174,6.349; R8 4.444,8.889 | drill 1.6 pad 2.184: S1 -7.876,3.049; S2 7.874,3.049 | hole 3.3: 5.714,-0.001; -5.716,-0.001
R0603 = smd 1 x 1.1: 1 -0.85,0; 2 0.85,0
HXXXX = smd 0.762 x 1.651: 1 -4.445,-4.255; 2 -3.175,-4.255; 3 -1.905,-4.255; 4 -0.635,-4.255; 5 0.635,-4.255; 6 1.905,-4.255; 7 3.175,-4.255; 8 4.445,-4.255; 9 4.445,4.255; 10 3.175,4.255; 11 1.905,4.255; 12 0.635,4.255; 13 -0.635,4.255; 14 -1.905,4.255; 15 -3.175,4.255; 16 -4.445,4.255
B1,27 = smd 1.27 x 1.27: TP 0,0
SOT230P700X180-4N = smd 1.626 x 0.889: 1 -3.2,2.311; 2 -3.2,0; 3 -3.2,-2.311 | smd 1.626 x 3.175: 4 3.2,0
PQFP-128_MQL = smd 1.753 x 0.279: 1 -8.077,9.25; 2 -8.077,8.75; 3 -8.077,8.25; 4 -8.077,7.75; 5 -8.077,7.25; 6 -8.077,6.75; 7 -8.077,6.25; 8 -8.077,5.75; 9 -8.077,5.25; 10 -8.077,4.75; 11 -8.077,4.25; 12 -8.077,3.75; 13 -8.077,3.25; 14 -8.077,2.75; 15 -8.077,2.25; 16 -8.077,1.75; 17 -8.077,1.25; 18 -8.077,0.75; 19 -8.077,0.25; 20 -8.077,-0.25; 21 -8.077,-0.75; 22 -8.077,-1.25; 23 -8.077,-1.75; 24 -8.077,-2.25; 25 -8.077,-2.75; 26 -8.077,-3.25; 27 -8.077,-3.75; 28 -8.077,-4.25; 29 -8.077,-4.75; 30 -8.077,-5.25; 31 -8.077,-5.75; 32 -8.077,-6.25; 33 -8.077,-6.75; 34 -8.077,-7.25; 35 -8.077,-7.75; 36 -8.077,-8.25; 37 -8.077,-8.75; 38 -8.077,-9.25; 65 8.077,-9.25; 66 8.077,-8.75; 67 8.077,-8.25; 68 8.077,-7.75; 69 8.077,-7.25; 70 8.077,-6.75; 71 8.077,-6.25; 72 8.077,-5.75; 73 8.077,-5.25; 74 8.077,-4.75; 75 8.077,-4.25; 76 8.077,-3.75; 77 8.077,-3.25; 78 8.077,-2.75; 79 8.077,-2.25; 80 8.077,-1.75; 81 8.077,-1.25; 82 8.077,-0.75; 83 8.077,-0.25; 84 8.077,0.25; 85 8.077,0.75; 86 8.077,1.25; 87 8.077,1.75; 88 8.077,2.25; 89 8.077,2.75; 90 8.077,3.25; 91 8.077,3.75; 92 8.077,4.25; 93 8.077,4.75; 94 8.077,5.25; 95 8.077,5.75; 96 8.077,6.25; 97 8.077,6.75; 98 8.077,7.25; 99 8.077,7.75; 100 8.077,8.25; 101 8.077,8.75; 102 8.077,9.25 | smd 0.279 x 1.753: 39 -6.25,-11.074; 40 -5.75,-11.074; 41 -5.25,-11.074; 42 -4.75,-11.074; 43 -4.25,-11.074; 44 -3.75,-11.074; 45 -3.25,-11.074; 46 -2.75,-11.074; 47 -2.25,-11.074; 48 -1.75,-11.074; 49 -1.25,-11.074; 50 -0.75,-11.074; 51 -0.25,-11.074; 52 0.25,-11.074; 53 0.75,-11.074; 54 1.25,-11.074; 55 1.75,-11.074; 56 2.25,-11.074; 57 2.75,-11.074; 58 3.25,-11.074; 59 3.75,-11.074; 60 4.25,-11.074; 61 4.75,-11.074; 62 5.25,-11.074; 63 5.75,-11.074; 64 6.25,-11.074; 103 6.25,11.074; 104 5.75,11.074; 105 5.25,11.074; 106 4.75,11.074; 107 4.25,11.074; 108 3.75,11.074; 109 3.25,11.074; 110 2.75,11.074; 111 2.25,11.074; 112 1.75,11.074; 113 1.25,11.074; 114 0.75,11.074; 115 0.25,11.074; 116 -0.25,11.074; 117 -0.75,11.074; 118 -1.25,11.074; 119 -1.75,11.074; 120 -2.25,11.074; 121 -2.75,11.074; 122 -3.25,11.074; 123 -3.75,11.074; 124 -4.25,11.074; 125 -4.75,11.074; 126 -5.25,11.074; 127 -5.75,11.074; 128 -6.25,11.074
SOIC127P600X175-8N = smd 2.184 x 0.559: 1 -2.362,1.905; 2 -2.362,0.635; 3 -2.362,-0.635; 4 -2.362,-1.905; 5 2.362,-1.905; 6 2.362,-0.635; 7 2.362,0.635; 8 2.362,1.905
SOD-123_MINI-SMA = smd 1.5 x 2.1: A 1.8,0; C -1.8,0
NE8FAV = drill 0.813: 1 -4.445,2.108; 2 -3.175,4.648; 3 -1.905,2.108; 4 -0.635,4.648; 5 0.635,2.108; 6 1.905,4.648; 7 3.175,2.108; 8 4.445,4.648 | drill 1.194: G -6.604,-10.541 | hole 1.7: -8.425,0; 8.425,0; 5.8,11.5; -5.8,11.5
SMD2.5X2 = smd 1 x 0.9: 1 -0.925,-0.775; 2 0.925,-0.775; 3 0.925,0.775; 4 -0.925,0.775

### Placement (x,y rotation side)
C1  76.9,54.5 270 top
C2  67.9,54.5 270 top
C3  64.8,78.9 270 top
C4  73.5,73.9 180 top
C9  14.9,51.8 0 bottom
C10  14.9,56.9 0 bottom
C11  50.5,26.6 0 bottom
C12  16.5,26.6 0 bottom
C13  66.16,55.69 0 bottom
C14  62.02,55.69 180 bottom
C15  25.01,9.51 0 top
C16  59.07,9.68 180 top
C17  18.5,72.35 0 top
C18  68,67.6 180 top
C19  68,65.7 180 top
C20  73.5,70.5 180 top
C21  73.5,72.2 180 top
C26  29.7,61.9 180 bottom
C27  37.2,61.9 0 bottom
C28  43.25,61.89 0 bottom
C29  29,50.6 90 bottom
C30  34.7,47.8 0 bottom
C31  49.2,52.1 270 bottom
C32  45.08,47.6 0 bottom
C33  28.7,76.3 90 top
C34  40.23,61.89 0 bottom
C35  29,58.6 90 bottom
C36  33.3,61.9 180 bottom
C37  29,55.1 270 bottom
C38  41,47.8 0 bottom
C39  49.2,55.7 90 bottom
C40  49.2,59 90 bottom
C41  53.2,56.3 270 top
C42  53.2,59.4 90 top
C43  53.2,65.8 0 top
C44  28.8,72.8 270 top
C45  62.9,73.6 0 top
C46  30.12,9.18 180 bottom
C47  50.93,9.67 0 bottom
CR1  72.8,62.1 270 top
J1  68.35,62.1 270 bottom
JP1  40.7,81 180 bottom
JP2  9,31 270 top
JP3  9,57 90 top
JP4  67.8,47.2 180 top
JP5  67.8,41 180 top
JP7  4,4 0 top
JP8  82,4 0 top
JP9  4,86 0 top
JP10  82,86 0 top
L3  73.4,67.3 0 top
LED1  60.7,81 180 top
LED2  57.26,80.91 180 top
LED3  52.7,81 180 top
LED4  38,33 270 top
LED5  38,27.5 270 top
LED6  72,33 270 top
LED7  72,27.5 270 top
P1  18.5,75.9 180 bottom
R1  58.84,80.84 270 top
R2  54.9,80.9 270 top
R5  19.5,20.1 180 bottom
R6  19.5,14.9 180 bottom
R7  53.5,21.4 180 bottom
R8  19.5,16.2 180 bottom
R9  53.5,20.1 180 bottom
R10  19.5,21.4 180 bottom
R11  19.5,22.7 180 bottom
R12  53.5,16.2 180 bottom
R13  53.5,14.9 180 bottom
R14  53.5,18.8 180 bottom
R15  53.5,17.5 180 bottom
R16  53.5,22.7 180 bottom
R17  19.5,18.8 180 bottom
R18  19.5,17.5 180 bottom
R19  14.9,50.5 0 bottom
R20  14.9,53.1 0 bottom
R21  14.9,58.2 0 bottom
R22  14.9,55.56 0 bottom
R23  66.97,53.28 270 bottom
R24  65.23,53.31 270 bottom
R25  61.12,53.18 270 bottom
R26  62.91,53.19 270 bottom
R27  62.9,80.9 270 top
R30  56.6,52.8 0 top
R31  56.6,54.5 0 top
R32  30.3,76.3 270 top
R33  31.9,76.3 270 top
R34  39.1,72.2 270 top
R35  56.8,64.5 90 top
R36  40.7,77.5 90 top
R37  58.1,64.5 90 top
R38  38.2,77.5 90 top
R39  35.6,77.5 90 top
R40  43.2,77.5 90 top
R41  38.09,30.54 0 top
R42  38.11,25.34 0 top
R43  72.1,30.8 0 top
R44  72.1,25.2 0 top
R45  30.3,72.8 270 top
R46  31.9,72.8 270 top
R47  20,78 90 top
R48  17,78 90 top
R49  62.9,72 0 top
T1  33.3,16.1 0 bottom
T2  64.96,16.2 0 bottom
TP1  58,78.2 0 top
TP3  62.9,78 0 top
TP4  52.2,78.2 0 top
TP5  54.9,78.2 0 top
U1  72.4,54.5 270 top
U2  69.7,76.8 270 top
U3  37.84,54.62 270 top
U4  56.2,70.5 270 top
U$5  50.23,69.33 180 top
U$6  17.39,60.56 180 top
U$7  40.14,39.02 0 top
U$8  43.5,20.8 90 top
U$9  60.23,71.8 90 top
X1  25,23 0 top
X2  59,23 0 top
Y1  55.9,57.5 90 top

### Tracks (layer width: path | path; a pad name or v marks a point on that pad's centre or on a via)
+1V8  (via drill 0.35)
  Top 0.178: U3.3 46.09,61.28 v41.9,57.1 | U3.43 28.23,58.87 30.9,56.2 v31.4,56.2 | U3.41 28.14,59.87 31.1,56.9 v31.4,56.9 | v38.2,57.1 40.15,59.05 40.15,60.91 40.09,60.97 U3.15 | U3.125 46,59.37 | 46,59.37 45.47,59.37 v43.2,57.1 | v44.1,53.3 46.16,55.37 U3.117 | 40.59,53.28 v40.6,53.3 40.6,49.1 40.59,49.09 U3.89 | U3.31 32.09,59.81 v34.9,57 | U3.50 31.36,55.37 v31.4,55.4 | U3.123 47,58.37 46,59.37
  Top 0.406: 58.71,79.86 R1.2 58.7,79.85 58.7,78.4 | v58.7,77.2 58.7,78.4 | TP1.TP 58.5,78.2 58.7,78.4 | v67.4,78.5 U2.3
  Bottom 0.178: 41.85,47.84 C38.1 41.85,52.85 | C31.1 C39.1 | C36.1 32.45,57.55 | 41.09,57.91 v41.9,57.1 | 45.65,54.85 v44.1,53.3
  Bottom 0.406: C37.1 C35.1 29.25,57.5 32.5,57.5 32.45,57.55 | C34.1 41.09,57.91 | 41.85,52.85 42,53 | C39.1 45.65,54.85 | C40.1 47.15,58.15 47,58
  other vias: 68.6,80 67.4,81.9 64.8,81.6
  pour Top: 63.83,89.1 63.83,79 68.9,79 68.9,89.1
  pour Bottom: 65.1,88.2 45.5,68.6 45.5,59 44.5,58 32,58 31,57 31,53 32,52 48,52 48.9,52.9 48.9,64.9 62.3,78.3 68.9,78.3 68.9,88.2
+3V3  (via drill 0.35)  (1 unrouted)
  Top 0.178: 58.37,68.14 U$9.C | U3.59 29.93,50.87 v30.1,50.7 | U3.24 35.59,61.22 v35.9,60.9 | U3.18 38.59,61.09 v38.4,60.9 | U3.9 43.09,60.72 v43.4,60.4 | U3.77 34.59,48.59 v34.9,48.9 | U3.37 29.1,62.68 v29.1,60.7 | v46.1,48.8 46.19,48.72 46.09,48.62 U3.100 | R47.1 20,76.6 19.6,76.2 17.5,76.2 17,75.7 | 17,75.7 17,73 17.1,72.9 C17.+ | R48.1 17,75.7
  Top 0.406: 58.37,68.14 U4.8 58.1,67.3 59.4,66 v60.4,66 | R30.2 R31.2 v59.9,54.5 | R49.2 v65.5,72 | R2.2 TP5.TP v53.6,78.2 | R41.2 38.98,30.5 v40.5,30.5 | R42.2 38.99,25.3 v40.3,25.3 | R43.2 v74.58,30.8 | R44.2 v74.7,25.2 | v50.1,64.5 51.05,64.5 C43.1 | P1.R3 17,69.96 17,72.25 C17.+ | v22,9 23.2,9 23.61,9.41 C15.+
  Top 0.61: C16.+ 63.72,9.68 v63.9,9.5
  Bottom 0.406: 36.45,11.87 T1.2 | P1.R3 16.7,69.44 16.7,63.7
  other vias: 67.4,58.9 67.4,57.9 68.4,57.9 68.4,58.9 68.4,56.9 67.4,56.9
  pour Bottom (rank 5): 4,86 82,86 82,4 4,4
  pour Top: 66.5,54.5 66.5,59.5 71.3,59.5 71.3,54.5
+5V  (via drill 0.35)
  Top 0.406: v64,76.5 62.9,77.6 TP3.TP R27.2
  Bottom 0.406: v64,76.5 73.5,76.5 v75.2,78.2
  pour Top: 85.3,54.5 73.7,54.5 73.7,79 70.6,79 70.6,83.1 85.3,83.1
GND  (via drill 0.35)  (1 unrouted)
  Top 0.178: 56.67,58.12 Y1.2 | U3.27 34,62.61 34,61 | 12.78,24.11 v13.98,25.32 | v12.2,51.9 12.2,52
  Top 0.406: 20.61,9.09 20.6,9.07 | 55.89,8.97 57.66,8.97 | 72.8,60.83 CR1.2 72.37,60.83 | Y1.2 56.67,58.48 | Y1.4 54.33,56.58 C41.2 | C42.2 53.2,60.6 | C17.- 20,72.25 20,70.5
  Bottom 0.178: C34.2 39.38,59.88 | 29,59.5 v30.1,60.6 | 34.15,60.65 v33.8,60.3 | 15.1,26.43 C12.2 | C10.2 13.95,57 v12,57 | C9.2 13.95,51.9 v12.2,51.9 | C32.2 44.1,47.6 v42.7,49
  Bottom 0.406: C14.2 v64.28,55.69 C13.2 | C27.2 C36.2 34.15,60.65 | C29.2 v29,53 C37.2 | 39.38,59.88 v39,59.5 | C28.2 42.4,59.9 v42,59.5 | C35.2 29,59.5 | C26.2 30.55,61.05 v30.1,60.6 | C30.2 33.85,48.65 v33.5,49 | C38.2 40.15,48.15 v39.4,48.9 | C31.2 47.05,51.25 v47,51.3 | C39.2 47.45,56.55 v47,57 | 47.27,10.23 v47.6,9.9 47.83,9.67 C47.2 | C40.2 49.85,59.85 50.2,60.2 v50.2,61.6 | C46.2 33.02,9.18 v33.2,9
  Bottom 0.61: v13.98,25.32 15.1,26.43 | C11.2 v47.4,26.6
  other vias: 32,51 31,59 36,51 40,51 44,51 35,59 69.7,81.9 70.8,71.6 68.7,71.6
  pour Top (rank 6): 5,85 81,85 81,5 5,5
  pour Route2: 6,84 80,84 80,6 6,6
  pour Route15: 3,87 3,3 83,3 83,87
ISET
  Top 0.178: 39.1,62.71 U3.17 39.09,63.91 39,64 39,71.25 R34.2
L1-1  (via drill 0.35)  (1 unrouted)
  Top 0.178: LED4.C 38.7,33.05 38.7,36.3 37.7,37.3 14.5,37.3 11.1,33.9 11.1,27.6 10.69,27.19 JP2.6 | v44.7,48.8 45.09,48.41 U3.98
  Route15 0.178: JP3.6 20.49,60.81 21.7,59.6 21.7,47.95 22.95,46.71 42.11,46.71 43.7,48.3 44.2,48.3 v44.7,48.8
L1-2  (via drill 0.35)  (1 unrouted)
  Top 0.178: LED5.C 38.75,28.5 38.25,29 36,29 35.5,29.5 35.5,36.2 35,36.7 14.7,36.7 11.6,33.6 11.6,25 11.25,24.65 JP2.7 | v43.8,48.9 44.59,48.12 U3.97
  Route15 0.178: JP3.7 10.65,63.35 12.6,61.4 20.7,61.4 22.3,59.8 22.3,48.19 23.34,47.15 41.95,47.15 43.51,48.9 v43.8,48.9
L2-1  (via drill 0.35)  (1 unrouted)
  Top 0.178: U3.106 53.16,49.87 v53.3,50 | v65,37.9 72.2,37.9 72.75,37.35 LED6.C
  Route15 0.178: v53.3,50 53.9,50.6 61.8,50.6 63.99,48.41 JP4.6
  Bottom 0.178: JP5.6 63.99,38.91 v65,37.9
L2-2  (via drill 0.35)  (1 unrouted)
  Top 0.178: v71.3,29.4 72.75,27.95 LED7.C | U3.105 52.94,49.37 v53.6,48.7
  Route15 0.178: JP4.7 61.45,48.15 60,49.6 54.5,49.6 v53.6,48.7
  Bottom 0.178: JP5.7 61.45,39.85 64.3,37 70.9,37 71.3,36.6 v71.3,29.4
L3-1  (via drill 0.35)
  Top 0.178: v47.5,49.1 47.5,48.7 47.8,48.4 48.87,48.4 U3.103
  Route15 0.178: v47.5,49.1 46.56,50.04 28.49,50.04 27.5,51.03 27.5,62.4 28.5,63.4 28.5,80 27.5,81 22.48,81 P1.L2
L3-2  (via drill 0.35)
  Top 0.178: v47.1,48.2 47.09,48.19 U3.102
  Route15 0.178: P1.L4 12.28,80.9 14.6,80.9 15.8,79.7 22.9,79.7 23.5,80.3 27.2,80.3 28.1,79.4 28.1,63.8 27,62.7 27,50.8 28.2,49.6 46.2,49.6 47.1,48.7 v47.1,48.2
N$1
  Bottom 0.178: R6.2 21.5,14.9 25.4,18.8 29.7,18.8 | 29.7,18.8 35.8,18.8 36.48,19.48 T1.15 | T1.10 30.12,19.23 29.7,18.8
N$2
  Top 0.178: LED2.A 58.81,81.66 R1.1
N$4
  Bottom 0.178: T2.15 68.14,19.54 67.6,19 61.3,19 | 61.3,19 58.7,19 58,18.3 58,15.3 57.6,14.9 R13.2 | T2.10 61.8,20.44 61.8,19.5 61.3,19
N$5
  Bottom 0.178: X2.8 61.9,26.1 56.7,26.1 56.1,25.5 56.1,20.5 55.7,20.1 R9.2
N$6
  Top 0.178: LED3.A R2.1
N$7
  Bottom 0.178: X1.4 23.75,27.65 21.6,25.5 21.6,23.1 21.2,22.7 R11.2
N$8
  Bottom 0.178: X1.8 27.9,26.1 22.8,26.1 22.1,25.4 22.1,20.5 21.7,20.1 R5.2
N$9
  Bottom 0.178: X1.7 27.27,24.2 25.4,24.2 23.1,21.9 23.1,17.3 22,16.2 R8.2
N$10
  Bottom 0.178: R20.1 C9.1 R19.1
N$11
  Bottom 0.178: X1.5 22.7,22.17 22.7,19.1 22.4,18.8 R17.2
N$12
  Bottom 0.178: X2.7 61.27,24.2 59.6,24.2 57.3,21.9 57.3,16.6 56.9,16.2 R12.2
N$13
  Bottom 0.178: C11.1 49,23.7 49,22 | 49,22 49,18.1 | 49,18.1 49,15.5 49.6,14.9 R13.1 | R7.1 49.6,21.4 49,22 | R15.1 49.6,17.5 49,18.1
N$14
  Bottom 0.178: R11.1 19.3,22.7 19.5,22.5 19.5,21.4 | 19.5,21.4 19.5,20.3 19.3,20.1 R5.1 | 20.4,21.4 R10.2 19.5,21.4
N$15
  Bottom 0.178: R16.2 55.2,22.7 55.6,23.1 55.6,25.5 57.75,27.65 X2.4
N$16
  Bottom 0.178: R16.1 53.1,22.7 53.5,22.3 53.5,21.4 | 53.5,21.4 53.5,20.5 53.1,20.1 R9.1 | R7.2 53.5,21.4
N$17
  Bottom 0.178: R17.1 19.3,18.8 19.5,18.6 19.5,17.5 | 19.5,17.5 19.5,16.4 19.3,16.2 R8.1 | R18.2 19.5,17.5
N$18
  Bottom 0.178: X2.5 56.7,22.17 56.7,19.3 56.2,18.8 R14.2
N$19
  Bottom 0.178: R14.1 53.1,18.8 53.5,18.4 53.5,17.5 | 53.5,17.5 53.5,16.6 53.1,16.2 R12.1 | R15.2 53.5,17.5
N$20
  Top 0.178: R41.1 LED4.A
N$23
  Top 0.406: LED1.A R27.1
N$24
  cutout Top: 69,23.5 69,35 68,36 50,36 49,35 49,12 50,11 53.5,11 55.5,13 71,13 72,14 72,21.5 71,22.5 70,22.5
  cutout Bottom: 69,23.5 69,35 68,36 50,36 49,35 49,12 50,11 53.5,11 55.5,13 71,13 72,14 72,21.5 71,22.5 70,22.5
N$26
  cutout Route15: 69,23.5 69,35 68,36 50,36 49,35 49,12 50,11 53.5,11 55.5,13 71,13 72,14 72,21.5 71,22.5 70,22.5
  cutout Route2: 69,23.5 69,35 68,36 50,36 49,35 49,12 50,11 53.5,11 55.5,13 71,13 72,14 72,21.5 71,22.5 70,22.5
N$27
  Top 0.178: R33.1 R32.1 28.7,75.55 C33.1
N$28
  Top 0.178: R42.1 LED5.A
N$29
  Top 0.178: R43.1 LED6.A
N$30
  Top 0.178: R44.1 LED7.A
N$31
  Top 0.178: R46.1 R45.1 C44.1
N$32  (via drill 0.35)
  Top 0.178: v14.7,23.5 v14.7,21.6 v14.7,17.9 15.1,17.5 v17.6,17.5
  Bottom 0.178: v14.7,17.9 14.7,15.6 15.39,14.91 arc90 15.4,14.9 R6.1 | v14.7,23.5 15.8,24.6 15.9,24.6 C12.1 | R10.1 14.9,21.4 v14.7,21.6 | v17.6,17.5 R18.1
N$33
  Bottom 0.178: R21.1 C10.1 R22.1
N$34
  Top 0.178: R48.2 15.14,78.85 P1.L3
N$35
  Top 0.178: R47.2 24.4,78.85 P1.L1
N$36
  Bottom 0.406: X2.G 52.4,9.74 C47.1
N$37
  Bottom 0.406: X1.G 25.44,12.46 C46.1
N$38
  cutout Route15: 35,23.5 35,35 34,36 16,36 15,35 15,12 16,11 26.5,11 28.5,13 39,13 40,14 40,21.5 39,22.5 36,22.5
  cutout Route2: 35,23.5 35,35 34,36 16,36 15,35 15,12 16,11 26.5,11 28.5,13 39,13 40,14 40,21.5 39,22.5 36,22.5
N$39
  cutout Top: 35,23.5 35,35 34,36 16,36 15,35 15,12 16,11 26.5,11 28.5,13 39,13 40,14 40,21.5 39,22.5 36,22.5
  cutout Bottom: 35,23.5 35,35 34,36 16,36 15,35 15,12 16,11 26.5,11 28.5,13 39,13 40,14 40,21.5 39,22.5 36,22.5
N$40
  Bottom 0.178: R24.1 65.26,54.13 R23.1 67.01,54.17 C13.1
N$41
  Bottom 0.178: C14.1 61.17,54.08 R25.1 R26.1
N$42
  cutout Top: 21.5,67.8 21.5,65.3 22.5,64.3 28,64.3 28,84 10,84 arc90 6,80 6,67.3 11.2,67.3 11.2,64.3 15.8,64.3 16.8,65.3 16.8,67.7 17.8,68.8 17.8,70.3 18.4,70.9 20,70.9 20.6,70.3 20.6,68.7
N$43
  cutout Bottom: 28,84 10,84 arc90 6,80 6,67.3 11.2,67.3 11.2,64.3 28,64.3
N$44
  cutout Route15: 28,84 10,84 arc90 6,80 6,67.3 11.2,67.3 11.2,64.3 28,64.3
N$45
  cutout Route2: 28,84 10,84 arc90 6,80 6,67.3 11.2,67.3 11.2,64.3 28,64.3
PS0
  Top 0.178: R31.1 55.12,53.87 U3.114
PS1
  Top 0.178: R30.1 55.19,53.37 U3.113
PW
  pour Top (rank 3): 74.2,62 68,62 68,69.4 74.2,69.4
RST_N  (via drill 0.35)
  Top 0.178: U$9.A C45.1 R49.1 62.05,71.05 v62.4,70.7 | U3.115 53.87,54.37 v53.97,54.47
  Route2 0.178: v62.4,70.7 54.33,70.7 v53.97,70.33
  Route15 0.178: v53.97,54.47 v53.97,70.33
RX1_ISO_N  (via drill 0.35, 0.35 pad 0.41)  (1 unrouted)
  Top 0.178: v12.2,14 v28.8,14 | U3.20 37.59,67.44 v37.37,67.67
  Route2 0.178: JP3.5 v13,58.27 15.14,58.27 19.92,63.05 28.24,63.05 32.74,67.55 37.25,67.55 v37.37,67.67
  Bottom 0.178: v12.2,14 11.1,15.1 11.1,29.3 10.67,29.73 JP2.5 | v28.8,14 28.86,13.95 T1.8 | R21.2 13.98,58.27 v13,58.27
RX1_ISO_P  (via drill 0.35, 0.35 pad 0.41)  (1 unrouted)
  Top 0.178: v12.4,15 22,15 22.5,15.5 v31.4,15.5 | U3.19 38.09,66.89 v38.13,66.94
  Route2 0.178: JP3.4 v13.16,55.73 20.08,62.65 28.46,62.65 32.86,67.05 38.02,67.05 v38.13,66.94
  Bottom 0.178: v12.4,15 11.6,15.8 11.6,31.8 11.13,32.27 JP2.4 | v31.4,15.5 T1.6 | JP3.4 v13.16,55.73 13.88,55.73 R22.2
RX1_M  (via drill 0.35)
  Top 0.178: X1.2 22.97,26.5 23.6,26.5 24.5,25.6 24.5,24.8 25.74,23.56 v27.87,23.56
  Bottom 0.178: v27.87,23.56 28.86,22.57 T1.9
RX1_P  (via drill 0.35)
  Top 0.178: v29.85,22.41 23.09,22.41 20.55,24.95 X1.1
  Bottom 0.178: v29.85,22.41 30.69,22.41 31.4,21.7 31.39,21.7 T1.11
RX2_ISO_N  (via drill 0.35)  (1 unrouted)
  Top 0.178: U3.5 45.09,66.58 45.5,67 v47.6,67
  Route2 0.178: JP4.5 66.53,49.47 66,50 63.9,50 61.3,52.6 61.3,66.7 60.7,67.3 47.9,67.3 v47.6,67
  Bottom 0.178: R25.2 61.12,51.58 63.3,49.4 65.9,49.4 66.53,48.77 JP4.5 66.53,49.47 | JP5.5 66.53,38.57 67.4,37.7 71.27,37.7 72.14,36.83 72.14,19.37 68.93,16.16 63.76,16.16 60.5,12.9 T2.8
RX2_ISO_P  (via drill 0.35)  (1 unrouted)
  Top 0.178: U3.4 45.59,65.78 v45.9,66.1
  Route2 0.178: JP4.4 69.07,48.33 67,50.4 64.1,50.4 61.7,52.8 61.7,66.9 60.9,67.7 47.5,67.7 v45.9,66.1
  Bottom 0.178: JP5.4 69.07,39.33 70.3,38.1 71.33,38.1 72.46,36.97 72.46,19.23 69.07,15.84 64,15.84 63.05,14.89 T2.6 | R26.2 62.91,51.09 63.8,50.2 68.5,50.2 69.1,49.6 69.1,47.23 JP4.4
RX2_M  (via drill 0.35)
  Top 0.178: X2.2 56.97,26.5 57.7,26.5 58.5,25.7 58.5,24.8 59.7,23.6 v60.4,23.6
  Bottom 0.178: v60.4,23.6 60.52,23.48 T2.9
RX2_P  (via drill 0.35)
  Top 0.178: X2.1 54.55,24.55 56.7,22.4 v61.9,22.4
  Bottom 0.178: v61.9,22.4 62.5,22.4 63.1,21.8 63.1,20.5 T2.11
RX3_ISO_N  (via drill 0.35)
  Top 0.178: v41.7,69.7 42.2,69.2 42.2,64 42.09,63.88 U3.11 | 32,71.95 R46.2 31.9,70.2 v31.6,69.9
  Route2 0.178: v41.7,69.7 40.9,70.5 32.2,70.5 v31.6,69.9 28.7,67 22.95,67 P1.R8
RX3_ISO_P  (via drill 0.35)
  Top 0.178: v42.6,69.6 42.6,62.71 U3.10 | R45.2 30.6,71.65 30.6,69.9 v30.35,69.65
  Route2 0.178: v42.6,69.6 42.6,69.7 41.3,71 31.7,71 v30.35,69.65 28.2,67.5 24.2,67.5 23.3,68.4 22.67,68.4 21.67,69.4 P1.R7
SCL  (via drill 0.35)
  Top 0.178: v54.5,51.6 54.23,51.87 U3.110 | R38.1 v38.2,74.69 | R37.1 58.1,63.2 v58.6,62.7
  Route2 0.178: v58.6,57.6 v58.6,52.9
  Route15 0.178: v54.5,51.6 57.3,51.6 v58.6,52.9 | v38.2,74.69 56.01,74.69 58.6,72.1 v58.6,62.7 v58.6,57.6
SCL_CPU
  Top 0.178: R38.2 38.16,78.39 JP1.2
SCL_EEPROM
  Top 0.178: R37.2 58.1,66.1 57.7,66.5 55.9,66.5 55.56,66.83 U4.6
SDA  (via drill 0.35)
  Top 0.178: R36.1 v40.7,75.7 | U3.111 50.34,52.37 50.5,52.2 53.4,52.2 v54,52.8 | R35.1 56.8,62.2 v57.6,61.4
  Route2 0.178: v57.6,61.4 59.3,61.4 v59.7,61
  Route15 0.178: v40.7,75.7 57.4,75.7 59.7,73.4 v59.7,61 59.7,56.1 56.5,52.9 54.1,52.9 v54,52.8
SDA_CPU
  Top 0.178: R36.2 JP1.3
SDA_EEPROM
  Top 0.178: U4.5 54.3,67.36 56.31,65.35 R35.2
SPIQ  (via drill 0.35)
  Top 0.178: R39.1 v35.6,73.6 | U3.109 52.23,51.37 52.3,51.3 v52.5,51.3
  Route15 0.178: v52.5,51.3 52.5,72.1 51,73.6 v35.6,73.6
SPIQ_CPU
  Top 0.178: R39.2 35.62,78.37 JP1.1
SPIS-N  (via drill 0.35)
  Top 0.178: R40.1 v43.2,72.3 | U3.112 51.19,52.87 v51.3,52.75
  Route15 0.178: v43.2,72.3 50.6,72.3 51.3,71.6 v51.3,52.75
SPIS-N_CPU
  Top 0.178: R40.2 43.24,78.39 JP1.4
TX1_ISO_N  (via drill 0.35, 0.35 pad 0.41)  (1 unrouted)
  Top 0.178: v13.3,16.5 21.5,16.5 22,17 v35.2,17 | U3.23 36.09,64.92 v35.8,65.2
  Route2 0.178: v35.8,65.2 33.2,65.2 29.3,61.3 21.9,61.3 20.2,59.6 20.2,54.7 18.3,52.8 15.2,52.8 v13.05,50.65 JP3.2
  Bottom 0.178: T1.3 v35.2,17 | v13.3,16.5 12.5,17.3 12.5,37 12.15,37.35 JP2.2 | JP3.2 v13.05,50.65 13.9,50.65 R19.2
TX1_ISO_P  (via drill 0.35, 0.35 pad 0.41)  (1 unrouted)
  Top 0.178: v12.8,15.8 21.8,15.8 22.3,16.3 v37.6,16.3 | U3.22 36.59,65.42 v36.1,65.9
  Route2 0.178: JP3.3 v13,53.19 18.19,53.19 19.8,54.8 19.8,59.8 21.7,61.7 29.2,61.7 33.4,65.9 v36.1,65.9
  Bottom 0.178: v12.8,15.8 12.1,16.5 12.1,34.21 11.5,34.81 JP2.3 | T1.1 37.74,16.16 v37.6,16.3 | R20.2 13.96,53.19 v13,53.19
TX1_M  (via drill 0.35)
  Top 0.178: v31.7,22.3 29.5,24.5 29.5,25.5 27.35,27.65 X1.6
  Bottom 0.178: v31.7,22.3 32.2,22.3 32.8,21.7 34.51,21.7 35.2,21 T1.14
TX1_P  (via drill 0.35)
  Top 0.178: X1.3 25.2,23 30.2,23 31.5,21.7 v35.6,21.7
  Bottom 0.178: v35.6,21.7 35.74,21.55 37.34,21.55 37.74,21.16 T1.16
TX2_ISO_N  (via drill 0.35)  (1 unrouted)
  Top 0.178: U3.8 43.59,68.58 v44.4,69.4 | v71.5,13.7 67.3,13.7 v66.9,13.3
  Route2 0.178: v44.4,69.4 44.8,69.4 45,69.2 62.6,69.2 63.5,68.3 63.5,52.7 65.05,51.15 68.5,51.15 70.25,49.4 72.3,49.4 74.15,47.55 JP4.2
  Bottom 0.178: JP5.2 73.83,40.68 73.83,15.6 71.93,13.7 v71.5,13.7 | R23.2 66.97,51.43 67.2,51.2 71.2,51.2 74.15,48.25 JP4.2 | v66.9,13.3 66.9,11.98 T2.3
TX2_ISO_P  (via drill 0.35)  (1 unrouted)
  Top 0.178: U3.7 44.09,68.08 v44.5,68.5
  Route2 0.178: JP4.3 71.61,47.89 70.6,48.9 70.1,48.9 68.2,50.8 64.9,50.8 63,52.7 63,67.9 62.1,68.8 44.8,68.8 v44.5,68.5
  Bottom 0.178: JP5.3 71.61,39.34 73.35,37.6 73.35,15.58 72.08,14.32 70.02,14.32 69.5,13.8 69.5,12.04 T2.1 | R24.2 65.23,51.47 66,50.7 71,50.7 71.61,50.09 JP4.3
TX2_M  (via drill 0.35)
  Top 0.178: X2.6 61.35,27.65 63.5,25.5 63.5,23.8 v65,22.3
  Bottom 0.178: v65,22.3 66.1,22.3 66.9,21.5 66.9,20.49 T2.14
TX2_P  (via drill 0.35)
  Top 0.178: v69.2,21.7 64.3,21.7 63,23 59.2,23 X2.3
  Bottom 0.178: T2.16 69.41,21.5 v69.2,21.7
TX3_ISO_N  (via drill 0.35)
  Top 0.178: U3.14 40.59,68.81 v40,69.4 | R33.2 32.25,75.45 33.5,74.2 33.5,71.7 34.1,71.1 v34.1,69.4
  Route2 0.178: v40,69.4 v34.1,69.4 32.8,69.4 27.7,64.3 16.7,64.3 15.32,65.67 P1.R2
TX3_ISO_P  (via drill 0.35)
  Top 0.178: v41.2,67.9 41.09,67.78 U3.13 | R32.2 31.25,74.5 32.6,74.5 33.1,74 33.1,71.5 33.7,70.9 33.7,69.8 33.3,69.4 v33.3,68.8
  Route2 0.178: v41.2,67.9 40.3,68.8 v33.3,68.8 32.8,68.8 27.89,63.89 16.09,63.89 14.05,65.93 P1.R1
X1
  Top 0.178: Y1.1 55.75,57.5 53.55,57.5 C41.1 52.05,57.15 51.84,57.37 U3.121
X2
  Top 0.178: U3.122 51.87,57.87 52.55,58.55 C42.1 55.12,58.55 Y1.3

### Text on the board
Top: ArmazEthernet / Rev A3 | 1
Route2: 2
Route15: 3
Bottom: ArmazEthernet / Rev A3 | 4
tPlace: GND | +3V3 | +1V8 | +5V | ArmazEthernet / Rev A3 | ETH3 | +5V | 230mA | GND | ETH1 | ETH2 | ArmazEthernet / Rev A3